# EAGLE design Acuator-MKI-RevisionCD (EAGLE 9.6.2)

## Sheet 1 of 2: Part Schematics
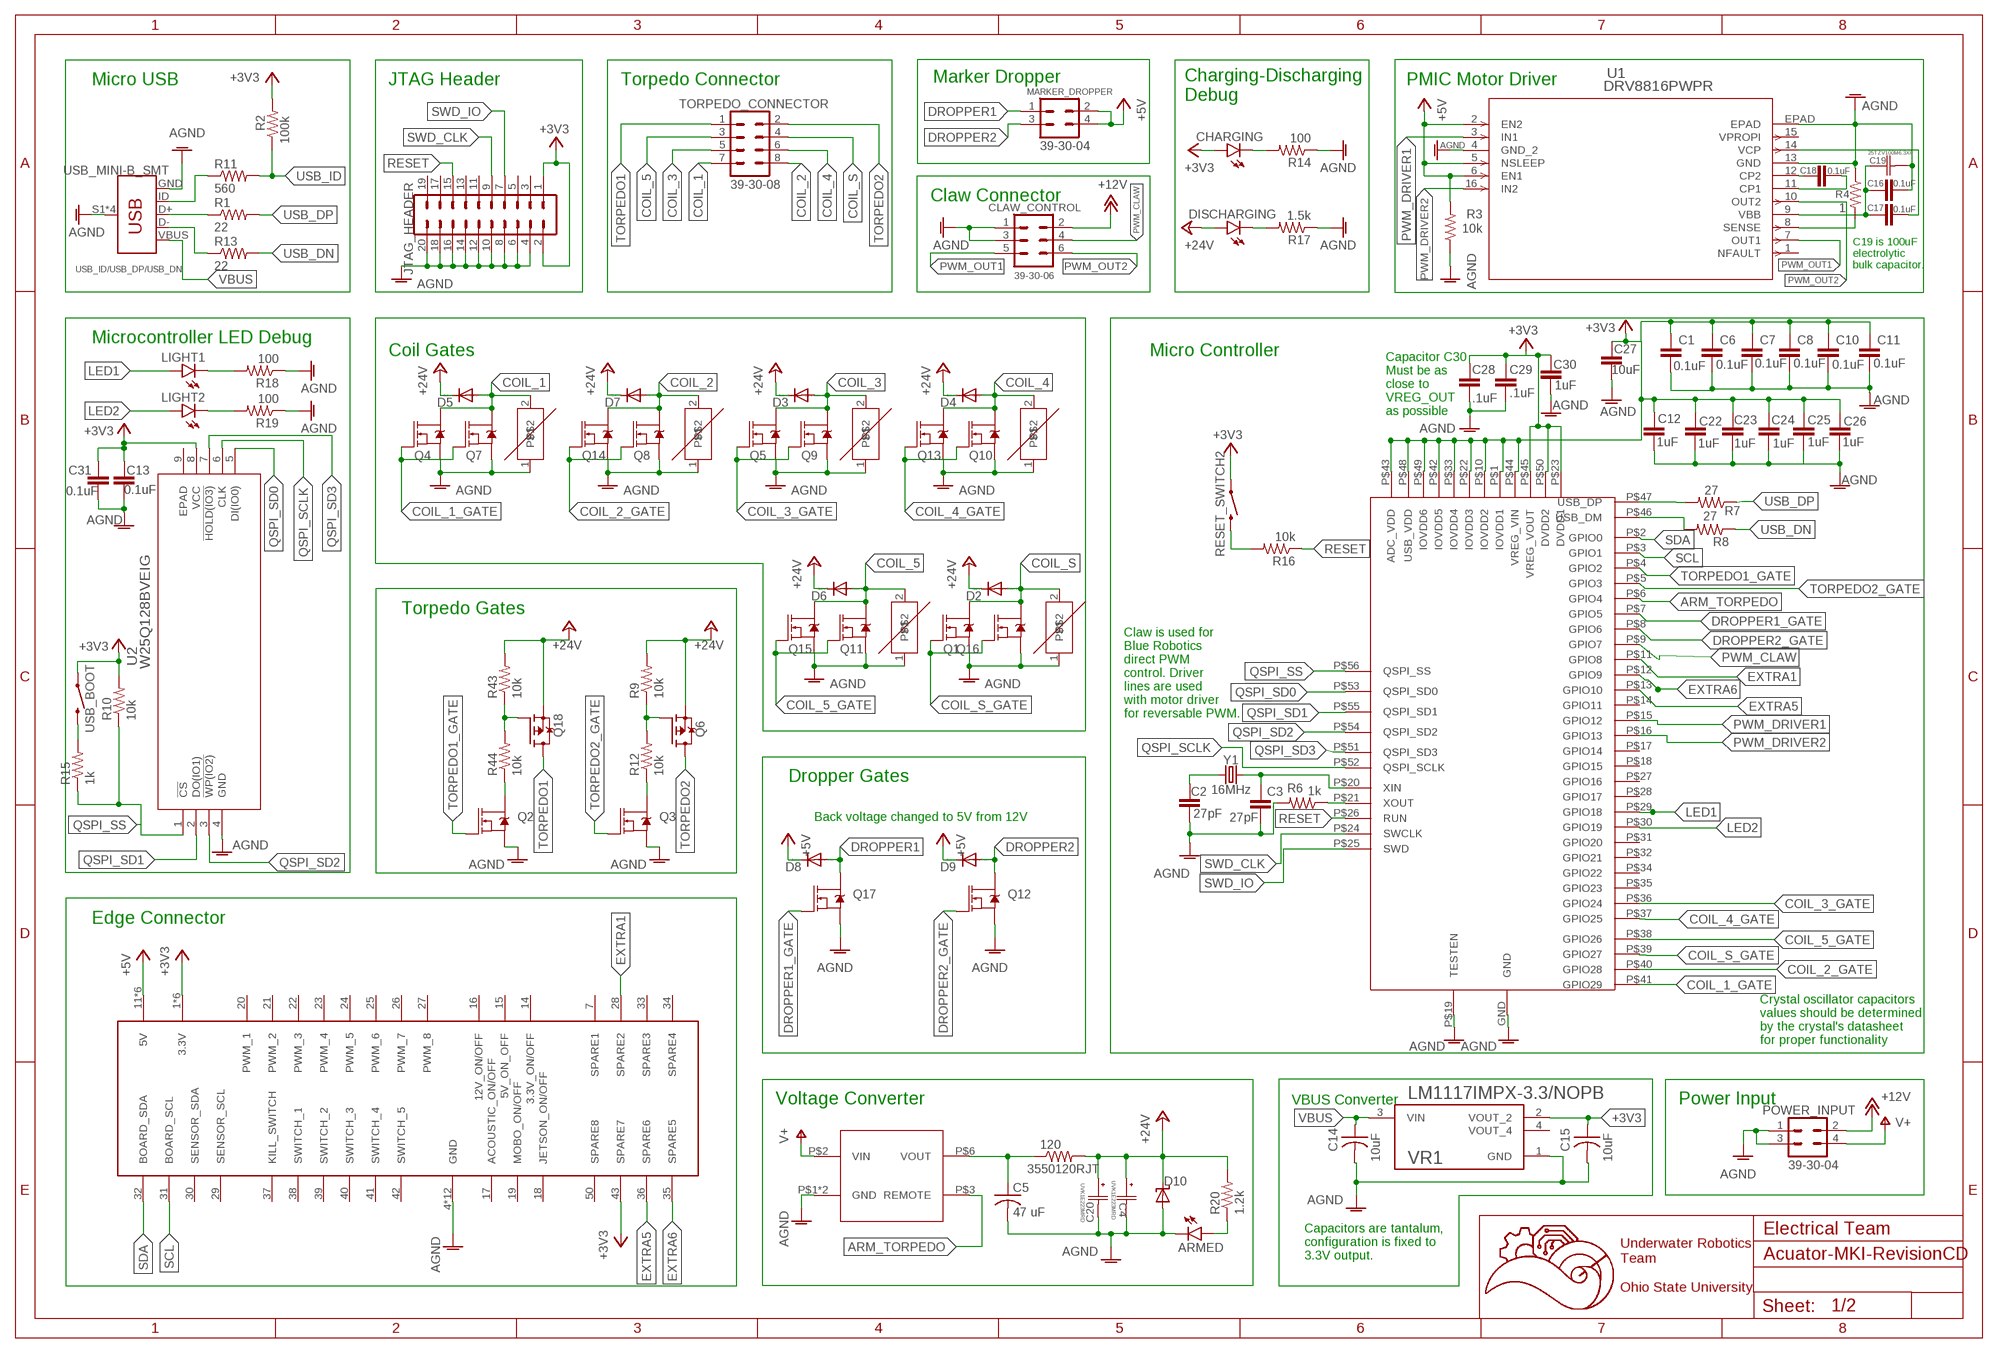
[diagram p0: schematic, sheet 1]

### Parts
120  3550120RJT  [3550120RJT]
ARMED  LEDCHIPLED_0603  [CHIPLED_0603]
C1  0.1uF  C-EUC0603  [C0603]
C2  27pF  C-EUC0603  [C0603]
C3  27pF  C-EUC0603  [C0603]
C4  UVK1E223MRD  [CAP_UFW_25X50_NCH]
C5  47 uF  C-USC1206K  [C1206K]
C6  0.1uF  C-EUC0603  [C0603]
C7  0.1uF  C-EUC0603  [C0603]
C8  0.1uF  C-EUC0603  [C0603]
C10  0.1uF  C-EUC0603  [C0603]
C11  0.1uF  C-EUC0603  [C0603]
C12  1uF  C-EUC0603  [C0603]
C13  0.1uF  C-EUC0603  [C0603]
C14  10uF  C-USC0603  [C0603]
C15  10uF  C-USC0603  [C0603]
C16  0.1uF  C-EUC0603  [C0603]
C17  0.1uF  C-EUC0603  [C0603]
C18  0.1uF  C-EUC0603  [C0603]
C19  25TZV100M6.3X8  [CAP_J-V_6P3X8_RUB]
C20  UVK1E223MRD  [CAP_UFW_25X50_NCH]
C22  1uF  C-EUC0603  [C0603]
C23  1uF  C-EUC0603  [C0603]
C24  1uF  C-EUC0603  [C0603]
C25  1uF  C-EUC0603  [C0603]
C26  1uF  C-EUC0603  [C0603]
C27  10uF  C-EUC0603  [C0603]
C28  .1uF  C-EUC0603  [C0603]
C29  .1uF  C-EUC0603  [C0603]
C30  1uF  C-EUC0603  [C0603]
C31  0.1uF  C-EUC0603  [C0603]
CHARGING  LEDCHIPLED_0603  [CHIPLED_0603]
CLAW_CONTROL  39-30-06  [39-30-?06?]
D2  DIODE-SMB  [SMB]
D3  DIODE-SMB  [SMB]
D4  DIODE-SMB  [SMB]
D5  DIODE-SMB  [SMB]
D6  DIODE-SMB  [SMB]
D7  DIODE-SMB  [SMB]
D8  DIODE-SMB  [SMB]
D9  DIODE-SMB  [SMB]
D10  SUPPRESSOR-SMBJ  [SMBJ]
DISCHARGING  LEDCHIPLED_0603  [CHIPLED_0603]
JTAG_HEADER  CONN_10X2  [2X10]
LIGHT1  LEDCHIPLED_0603  [CHIPLED_0603]
LIGHT2  LEDCHIPLED_0603  [CHIPLED_0603]
MARKER_DROPPER  39-30-04  [39-30-?04?]
POWER_INPUT  39-30-04  [39-30-?04?]
Q1  MOSFET-NCH-AO3404A  [SOT23-3]
Q2  MOSFET-NCH-AO3404A  [SOT23-3]
Q3  MOSFET-NCH-AO3404A  [SOT23-3]
Q4  MOSFET-NCH-AO3404A  [SOT23-3]
Q5  MOSFET-NCH-AO3404A  [SOT23-3]
Q6  FDD4141TO252  [TO252]
Q7  MOSFET-NCH-AO3404A  [SOT23-3]
Q8  MOSFET-NCH-AO3404A  [SOT23-3]
Q9  MOSFET-NCH-AO3404A  [SOT23-3]
Q10  MOSFET-NCH-AO3404A  [SOT23-3]
Q11  MOSFET-NCH-AO3404A  [SOT23-3]
Q12  MOSFET-NCH-AO3404A  [SOT23-3]
Q13  MOSFET-NCH-AO3404A  [SOT23-3]
Q14  MOSFET-NCH-AO3404A  [SOT23-3]
Q15  MOSFET-NCH-AO3404A  [SOT23-3]
Q16  MOSFET-NCH-AO3404A  [SOT23-3]
Q17  MOSFET-NCH-AO3404A  [SOT23-3]
Q18  FDD4141TO252  [TO252]
R1  22  R-US_R0603  [R0603]
R2  100k  R-US_R0603  [R0603]
R3  10k  R-US_R0603  [R0603]
R4  1  R-US_R0805  [R0805]
R6  1k  R-US_R0603  [R0603]
R7  27  R-US_R0603  [R0603]
R8  27  R-US_R0603  [R0603]
R9  10k  R-US_R0603  [R0603]
R10  10k  R-US_R0603  [R0603]
R11  560  R-US_R0603  [R0603]
R12  10k  R-US_R0603  [R0603]
R13  22  R-US_R0603  [R0603]
R14  100  R-US_R0805  [R0805]
R15  1k  R-US_R0603  [R0603]
R16  10k  R-US_R0603  [R0603]
R17  1.5k  R-US_R0805  [R0805]
R18  100  R-US_R0805  [R0805]
R19  100  R-US_R0805  [R0805]
R20  1.2k  R-US_R0805  [R0805]
R43  10k  R-US_R0603  [R0603]
R44  10k  R-US_R0603  [R0603]
RESET_SWITCH2  MOMENTARY-SWITCH-SPST-PTH-6.0MM  [TACTILE_SWITCH_PTH_6.0MM]
TORPEDO_CONNECTOR  39-30-08  [39-30-?08?]
U1  DRV8816PWPR  [PWP_16]
U2  W25Q128BVEIG  [WIN_E-8_WIN]
U$1  5530843-EDGE  [5530843-6-BOARDFINGERS]
U$2  ERZ-VF2M270ERZ-VF2M270  [RESM8060X320N]
U$3  ERZ-VF2M270ERZ-VF2M270  [RESM8060X320N]
U$4  ERZ-VF2M270ERZ-VF2M270  [RESM8060X320N]
U$5  ERZ-VF2M270ERZ-VF2M270  [RESM8060X320N]
U$6  TMR6-2415  [TMR6-2415]
U$7  ERZ-VF2M270ERZ-VF2M270  [RESM8060X320N]
U$8  ERZ-VF2M270ERZ-VF2M270  [RESM8060X320N]
U$9  RP2040  [RP2040]
USB_BOOT  MOMENTARY-SWITCH-SPST-PTH-6.0MM  [TACTILE_SWITCH_PTH_6.0MM]
USB_ID/USB_DP/USB_DN  USB_MINI-B_SMT  [USB-MINIB]
VR1  LM1117IMPX-3.3/NOPB  [VREG_LM1117IMPX-3.3/NOPB]
Y1  16MHz  CRYSTAL-16MHZPTH-HC49US  [HC49US]

### Nets
+3V3: C1.1 C6.1 C7.1 C8.1 C10.1 C11.1 C12.1 C13.1 C15.1 C22.1 C23.1 C24.1 C25.1 C26.1 C27.1 C28.1 C29.1 C30.1 C31.1 CHARGING.A JTAG_HEADER.1 JTAG_HEADER.2 R2.2 R10.2 RESET_SWITCH2.1 U2.8(VCC) U$1.1(3.3V) U$1.2(3.3V) U$1.3(3.3V) U$1.43(SPARE7) U$1.54(3.3V) U$1.55(3.3V) U$1.56(3.3V) U$9.P$1(IOVDD1) U$9.P$10(IOVDD2) U$9.P$22(IOVDD3) U$9.P$23(DVDD1) U$9.P$33(IOVDD4) U$9.P$42(IOVDD5) U$9.P$43(ADC_VDD) U$9.P$44(VREG_VIN) U$9.P$45(VREG_VOUT) U$9.P$48(USB_VDD) U$9.P$49(IOVDD6) U$9.P$50(DVDD2) USB_BOOT.1 VR1.2(VOUT_2)
+5V: D8.C D9.C MARKER_DROPPER.2 MARKER_DROPPER.4 R3.2 U1.2(EN2) U1.5(NSLEEP) U1.6(EN1) U$1.11(5V) U$1.12(5V) U$1.13(5V) U$1.44(5V) U$1.45(5V) U$1.46(5V)
+12V: CLAW_CONTROL.2 POWER_INPUT.2
+24V: 120.P$2 C4.1 C20.1 D2.C D3.C D4.C D5.C D6.C D7.C D10.C DISCHARGING.A Q6.2(S) Q18.2(S) R9.2 R20.2 R43.2
AGND: ARMED.C C1.2 C2.2 C3.2 C4.2 C5.2 C6.2 C7.2 C8.2 C10.2 C11.2 C12.2 C13.2 C14.2 C15.2 C16.2 C19.2 C20.2 C22.2 C23.2 C24.2 C25.2 C26.2 C27.2 C28.2 C29.2 C30.2 C31.2 CLAW_CONTROL.1 CLAW_CONTROL.3 D10.A JTAG_HEADER.4 JTAG_HEADER.6 JTAG_HEADER.8 JTAG_HEADER.10 JTAG_HEADER.12 JTAG_HEADER.14 JTAG_HEADER.16 JTAG_HEADER.18 JTAG_HEADER.20 POWER_INPUT.1 POWER_INPUT.3 Q1.2(S) Q2.2(S) Q3.2(S) Q4.2(S) Q5.2(S) Q7.2(S) Q8.2(S) Q9.2(S) Q10.2(S) Q11.2(S) Q12.2(S) Q13.2(S) Q14.2(S) Q15.2(S) Q16.2(S) Q17.2(S) R3.1 R4.1 R6.2 R14.1 R17.1 R18.1 R19.1 U1.4(GND_2) U1.13(GND) U1.EPAD U2.4(GND) U$1.4(GND) U$1.5(GND) U$1.6(GND) U$1.8(GND) U$1.9(GND) U$1.10(GND) U$1.47(GND) U$1.48(GND) U$1.49(GND) U$1.51(GND) U$1.52(GND) U$1.53(GND) U$2.1 U$3.1 U$4.1 U$5.1 U$6.P$1(GND) U$6.P$7(GND) U$7.1 U$8.1 U$9.GND U$9.P$19(TESTEN) USB_ID/USB_DP/USB_DN.GND USB_ID/USB_DP/USB_DN.S1(SHIELD) USB_ID/USB_DP/USB_DN.S2(SHIELD) USB_ID/USB_DP/USB_DN.S3(SHIELD) USB_ID/USB_DP/USB_DN.S4(SHIELD) VR1.1(GND)
ARM_TORPEDO: U$6.P$3(REMOTE) U$9.P$6(GPIO4)
COIL_1: D5.A Q4.3(D) Q7.3(D) TORPEDO_CONNECTOR.7 U$8.2
COIL_1_GATE: Q4.1(G) Q7.1(G) U$9.P$41(GPIO29)
COIL_2: D7.A Q8.3(D) Q14.3(D) TORPEDO_CONNECTOR.8 U$7.2
COIL_2_GATE: Q8.1(G) Q14.1(G) U$9.P$40(GPIO28)
COIL_3: D3.A Q5.3(D) Q9.3(D) TORPEDO_CONNECTOR.5 U$5.2
COIL_3_GATE: Q5.1(G) Q9.1(G) U$9.P$36(GPIO24)
COIL_4: D4.A Q10.3(D) Q13.3(D) TORPEDO_CONNECTOR.6 U$4.2
COIL_4_GATE: Q10.1(G) Q13.1(G) U$9.P$37(GPIO25)
COIL_5: D6.A Q11.3(D) Q15.3(D) TORPEDO_CONNECTOR.3 U$3.2
COIL_5_GATE: Q11.1(G) Q15.1(G) U$9.P$38(GPIO26)
COIL_S: D2.A Q1.3(D) Q16.3(D) TORPEDO_CONNECTOR.4 U$2.2
COIL_S_GATE: Q1.1(G) Q16.1(G) U$9.P$39(GPIO27)
DROPPER1: D8.A MARKER_DROPPER.1 Q17.3(D)
DROPPER1_GATE: Q17.1(G) U$9.P$7(GPIO5)
DROPPER2: D9.A MARKER_DROPPER.3 Q12.3(D)
DROPPER2_GATE: Q12.1(G) U$9.P$8(GPIO6)
EXTRA1: U$1.28(SPARE2) U$9.P$11(GPIO8)
EXTRA5: U$1.36(SPARE6) U$9.P$13(GPIO10)
EXTRA6: U$1.35(SPARE5) U$9.P$12(GPIO9)
LED1: LIGHT1.A U$9.P$29(GPIO18)
LED2: LIGHT2.A U$9.P$30(GPIO19)
N$2: C2.1 Y1.1
N$3: C3.1 U$9.P$20(XIN) Y1.2
N$4: CHARGING.C R14.2
N$5: R6.1 U$9.P$21(XOUT)
N$6: R11.1 USB_ID/USB_DP/USB_DN.ID
N$7: R1.1 USB_ID/USB_DP/USB_DN.D+
N$8: R13.1 USB_ID/USB_DP/USB_DN.D-
N$10: ARMED.A R20.1
N$11: R7.2 U$9.P$47(USB_DP)
N$12: R8.2 U$9.P$46(USB_DM)
N$15: DISCHARGING.C R17.2
N$16: LIGHT1.C R18.2
N$17: LIGHT2.C R19.2
N$18: R15.2 USB_BOOT.3
N$19: R16.2 RESET_SWITCH2.3
N$26: 120.P$1 C5.1 U$6.P$6(VOUT)
N$33: Q18.1(G) R43.1 R44.2
N$34: Q2.3(D) R44.1
N$35: Q6.1(G) R9.1 R12.2
N$36: Q3.3(D) R12.1
N$45: R4.2 U1.8(SENSE)
N$46: C17.2 U1.14(VCP)
N$47: C16.1 C17.1 C19.1 U1.9(VBB)
N$48: C18.2 U1.11(CP1)
N$49: C18.1 U1.12(CP2)
PWM_CLAW: CLAW_CONTROL.4 U$9.P$9(GPIO7)
PWM_DRIVER1: U1.3(IN1) U$9.P$15(GPIO12)
PWM_DRIVER2: U1.16(IN2) U$9.P$16(GPIO13)
PWM_OUT1: CLAW_CONTROL.5 U1.7(OUT1)
PWM_OUT2: CLAW_CONTROL.6 U1.10(OUT2)
QSPI_SCLK: U2.6(CLK) U$9.P$52(QSPI_SCLK)
QSPI_SD0: U2.5(DI(IO0)) U$9.P$53(QSPI_SD0)
QSPI_SD1: U2.2(DO(IO1)) U$9.P$55(QSPI_SD1)
QSPI_SD2: U2.3(!WP(IO2)) U$9.P$54(QSPI_SD2)
QSPI_SD3: U2.7(!HOLD(IO3)) U$9.P$51(QSPI_SD3)
QSPI_SS: R10.1 R15.1 U2.1(!CS) U$9.P$56(QSPI_SS)
RESET: JTAG_HEADER.15 R16.1 U$9.P$26(RUN)
SCL: U$1.31(BOARD_SCL) U$9.P$3(GPIO1)
SDA: U$1.32(BOARD_SDA) U$9.P$2(GPIO0)
SWD_CLK: JTAG_HEADER.9 U$9.P$24(SWCLK)
SWD_IO: JTAG_HEADER.7 U$9.P$25(SWD)
TORPEDO1: Q18.3(D) TORPEDO_CONNECTOR.1
TORPEDO1_GATE: Q2.1(G) U$9.P$4(GPIO2)
TORPEDO2: Q6.3(D) TORPEDO_CONNECTOR.2
TORPEDO2_GATE: Q3.1(G) U$9.P$5(GPIO3)
USB_DN: R8.1 R13.2
USB_DP: R1.2 R7.1
USB_ID: R2.1 R11.2
V+: POWER_INPUT.4 U$6.P$2(VIN)
VBUS: C14.1 USB_ID/USB_DP/USB_DN.VBUS VR1.3(VIN)
Unconnected: JTAG_HEADER.3 JTAG_HEADER.5 JTAG_HEADER.11 JTAG_HEADER.13 JTAG_HEADER.17 JTAG_HEADER.19 U1.1(NFAULT) U1.15(VPROPI) U2.9(EPAD) U$1.7(SPARE1) U$1.14(3.3V_ON/OFF) U$1.15(5V_ON_OFF) U$1.16(12V_ON/OFF) U$1.17(ACOUSTIC_ON/OFF) U$1.18(JETSON_ON/OFF) U$1.19(MOBO_ON/OFF) U$1.20(PWM_1) U$1.21(PWM_2) U$1.22(PWM_3) U$1.23(PWM_4) U$1.24(PWM_5) U$1.25(PWM_6) U$1.26(PWM_7) U$1.27(PWM_8) U$1.29(SENSOR_SCL) U$1.30(SENSOR_SDA) U$1.33(SPARE3) U$1.34(SPARE4) U$1.37(KILL_SWITCH) U$1.38(SWITCH_1) U$1.39(SWITCH_2) U$1.40(SWITCH_3) U$1.41(SWITCH_4) U$1.42(SWITCH_5) U$1.50(SPARE8) U$9.P$14(GPIO11) U$9.P$17(GPIO14) U$9.P$18(GPIO15) U$9.P$27(GPIO16) U$9.P$28(GPIO17) U$9.P$31(GPIO20) U$9.P$32(GPIO21) U$9.P$34(GPIO22) U$9.P$35(GPIO23) VR1.4(VOUT_4)

### Notes on the sheet
- Micro USB | JTAG Header | Torpedo Connector | Marker Dropper | PMIC Motor Driver
- Charging-Discharging 
  Debug
- Claw Connector
- C19 is 100uF
  electrolytic
  bulk capacitor.
- Microcontroller LED Debug
- Coil Gates | Micro Controller
- Capacitor C30 
  Must be as 
  close to 
  VREG_OUT
  as possible
- Torpedo Gates
- Claw is used for
  Blue Robotics
  direct PWM
  control. Driver
  lines are used
  with motor driver
  for reversable PWM.
- Dropper Gates
- Back voltage changed to 5V from 12V
- Edge Connector
- Crystal oscillator capacitors
  values should be determined
  by the crystal's datasheet
  for proper functionality
- Voltage Converter | VBUS Converter | Power Input
- Electrical Team
- Capacitors are tantalum, 
  configuration is fixed to 
  3.3V output.
- Underwater Robotics
  Team
  
  Ohio State University

## Sheet 2 of 2: Notes
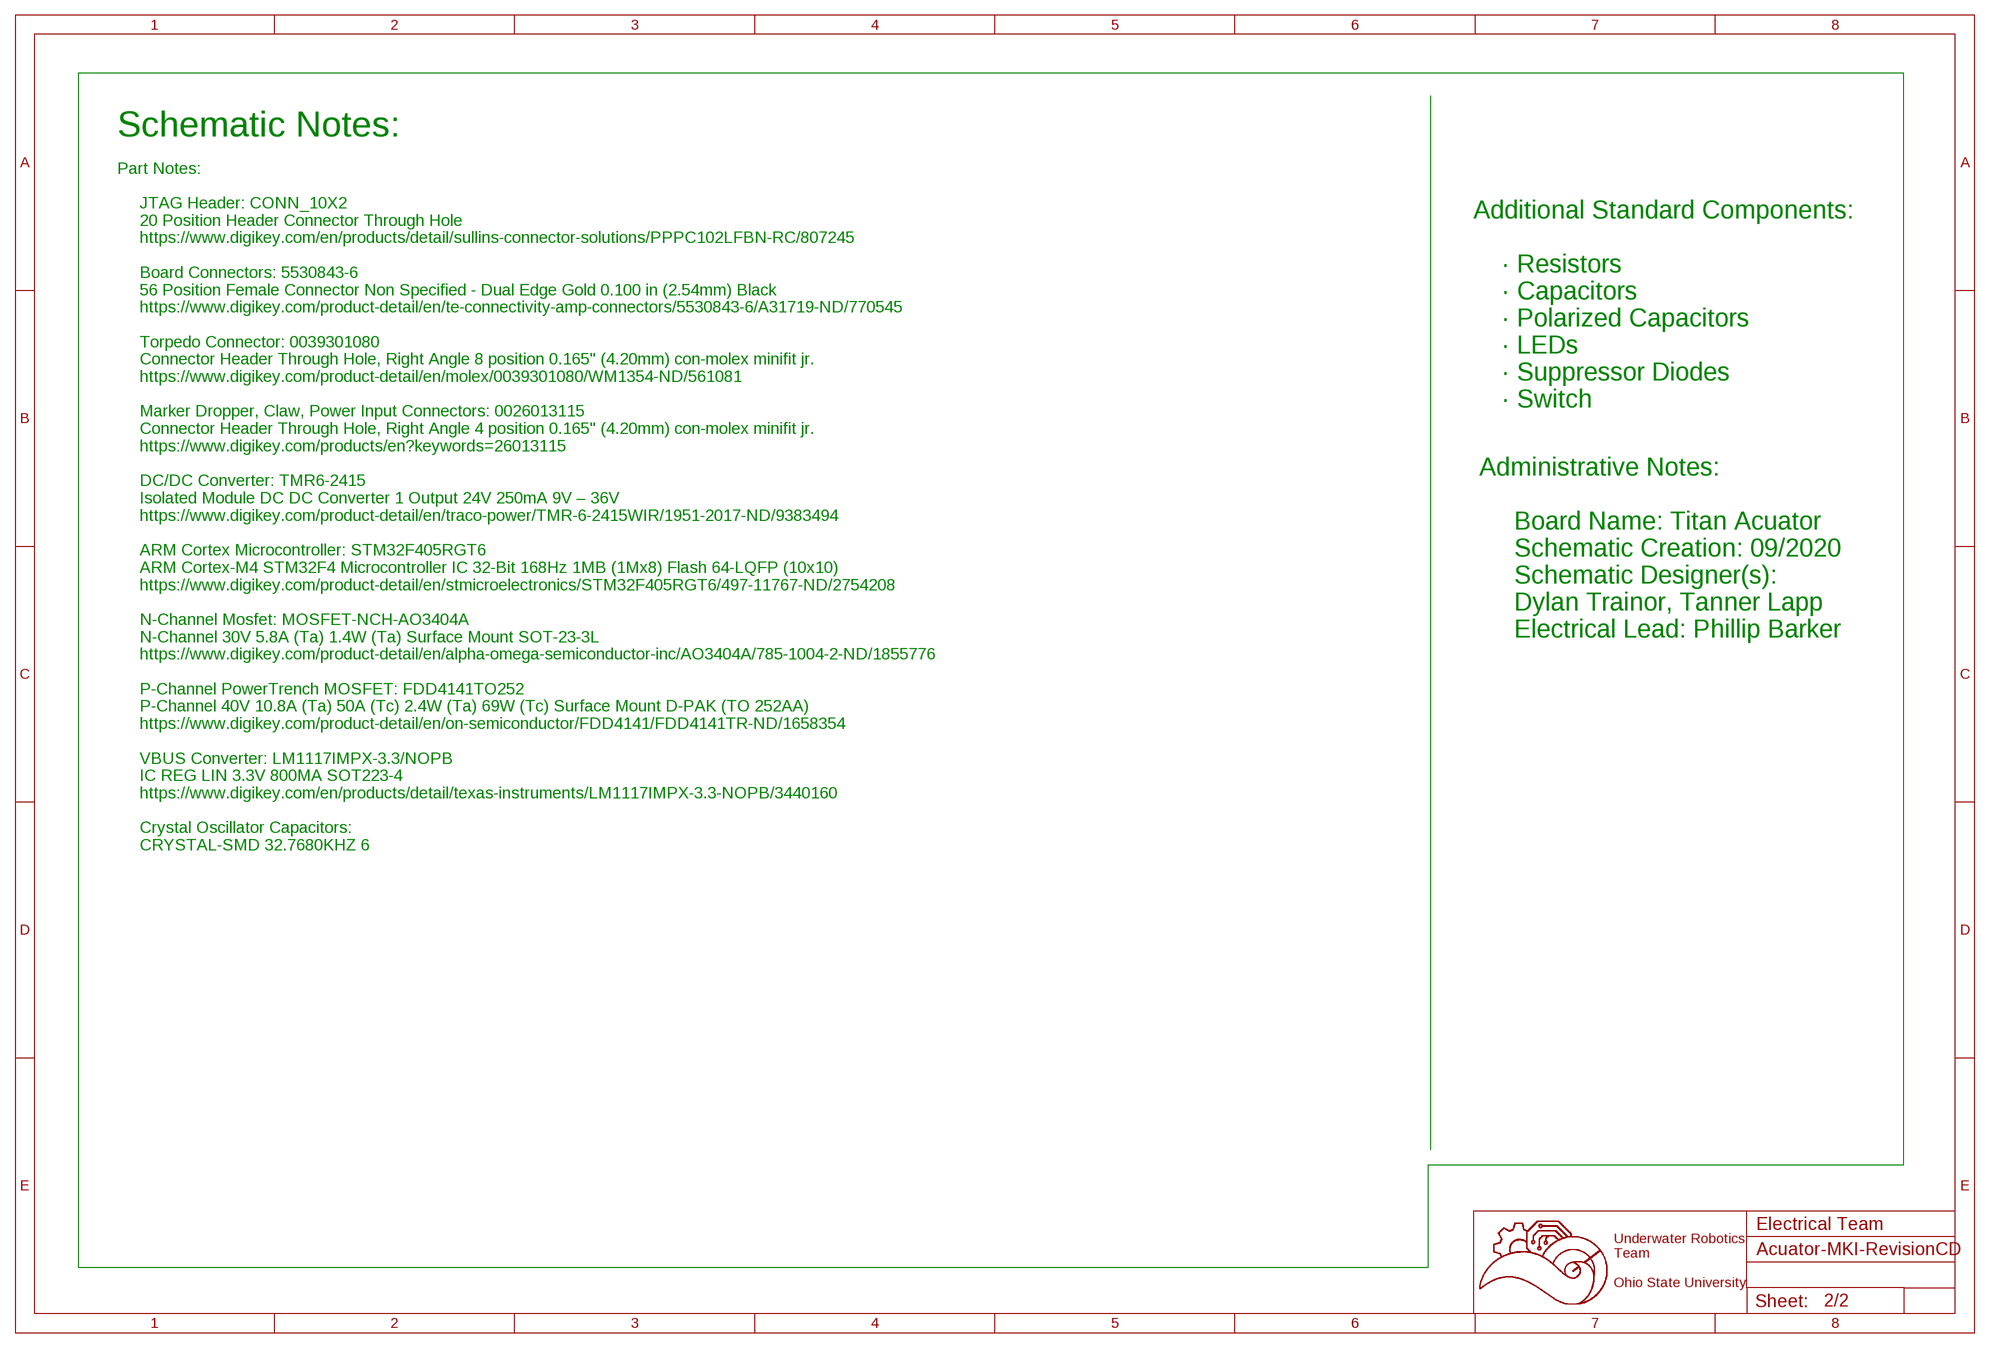
[diagram p1: schematic, sheet 2]

### Notes on the sheet
- Schematic Notes:
- Part Notes:
  
       JTAG Header: CONN_10X2
       20 Position Header Connector Through Hole 
       https://www.digikey.com/en/products/detail/sullins-connector-solutions/PPPC102LFBN-RC/807245
    
       Board Connectors: 5530843-6 
       56 Position Female Connector Non Specified - Dual Edge Gold 0.100 in (2.54mm) Black 
       https://www.digikey.com/product-detail/en/te-connectivity-amp-connectors/5530843-6/A31719-ND/770545 
    
       Torpedo Connector: 0039301080 
       Connector Header Through Hole, Right Angle 8 position 0.165" (4.20mm) con-molex minifit jr. 
       https://www.digikey.com/product-detail/en/molex/0039301080/WM1354-ND/561081 
    
       Marker Dropper, Claw, Power Input Connectors: 0026013115 
       Connector Header Through Hole, Right Angle 4 position 0.165" (4.20mm) con-molex minifit jr. 
       https://www.digikey.com/products/en?keywords=26013115 
    
       DC/DC Converter: TMR6-2415 
       Isolated Module DC DC Converter 1 Output 24V 250mA 9V – 36V 
       https://www.digikey.com/product-detail/en/traco-power/TMR-6-2415WIR/1951-2017-ND/9383494 
    
       ARM Cortex Microcontroller: STM32F405RGT6 
       ARM Cortex-M4 STM32F4 Microcontroller IC 32-Bit 168Hz 1MB (1Mx8) Flash 64-LQFP (10x10) 
       https://www.digikey.com/product-detail/en/stmicroelectronics/STM32F405RGT6/497-11767-ND/2754208 
    
       N-Channel Mosfet: MOSFET-NCH-AO3404A 
       N-Channel 30V 5.8A (Ta) 1.4W (Ta) Surface Mount SOT-23-3L 
       https://www.digikey.com/product-detail/en/alpha-omega-semiconductor-inc/AO3404A/785-1004-2-ND/1855776 
    
       P-Channel PowerTrench MOSFET: FDD4141TO252 
       P-Channel 40V 10.8A (Ta) 50A (Tc) 2.4W (Ta) 69W (Tc) Surface Mount D-PAK (TO 252AA) 
       https://www.digikey.com/product-detail/en/on-semiconductor/FDD4141/FDD4141TR-ND/1658354
  
       VBUS Converter: LM1117IMPX-3.3/NOPB
       IC REG LIN 3.3V 800MA SOT223-4
       https://www.digikey.com/en/products/detail/texas-instruments/LM1117IMPX-3.3-NOPB/3440160
    
       Crystal Oscillator Capacitors: 
       CRYSTAL-SMD 32.7680KHZ 6PF  3.2X1.5MM 
       https://www.digikey.com/en/products/detail/micro-crystal-ag/CM7V-T1A-32-768KHZ-6PF-20PPM-TA-QC/10499118
       CRYSTAL-16MHZPTH-HC49US (CRYSTAL-16MHZ)
       https://www.digikey.com/en/products/detail/abracon-llc/ABM3B-16-000MHZ-B2-T/675317?s=N4IgTCBcDaIKwGY4FoCcBGMZnuQOQBEQBdAXyA 
  
       ERZ-VF2M270 Varistor
       VARISTOR 27V 125A 2SMD JLEAD
       https://www.digikey.com/en/products/detail/panasonic-electronic-components/ERZ-VF2M270/672899
  
       3550120RJT Resistor
       RES 3550 120 Ohm 5% 5W
       https://www.digikey.com/en/products/detail/te-connectivity-passive-product/3550120RJT/9927251
  
       DRV8816PWPR Motor Driver
       IC MOTOR DRIVER 8V-38V 16HTSSOP
       https://www.digikey.com/en/products/detail/texas-instruments/DRV8816PWPR/4439658
  
       25TZV100M6.3X8 Electrolytic Capacitor
       CAP ALUM 100UF 20% 25V SMD
       https://www.digikey.com/en/products/detail/rubycon/25TZV100M6-3X8/3134865
  
       UVK1E223MRD 22mF Capacitor
       CAP ALUM 22000UF 20% 25V RADIAL
       https://www.digikey.com/en/products/detail/nichicon/UVK1E223MRD/2539394
- Additional Standard Components:
  
       · Resistors 
       · Capacitors 
       · Polarized Capacitors 
       · LEDs 
       · Suppressor Diodes 
       · Switch
- Administrative Notes:
  
       Board Name: Titan Acuator
       Schematic Creation: 09/2020
       Schematic Designer(s): 
       Dylan Trainor, Tanner Lapp
       Electrical Lead: Phillip Barker
- Electrical Team
- Underwater Robotics
  Team
  
  Ohio State University

## Library data of the parts
120 = 3550120RJT:3550120RJT
ARMED CHARGING DISCHARGING LIGHT1 LIGHT2 = led:LED: LED OSRAM: - CHIPLED LG R971, LG N971, LY N971, LG Q971, LY Q971, LO R971, LY R971 LH N974, LH R974 LS Q976, LO Q976, LY Q976 LO Q996 - Hyper CHIPLED LW Q18S LB Q993, LB Q99A, LB R99A - SideLED LS A670, LO A670, LY A670, LG A670, LP A670 LB A673, LV A673, LT A673, LW A673 LH A674 LY A675 LS A676, LA A676, LO A676, LY A676, LW A676 LS A679, LY A679, LG A679 - Hyper Micro SIDELED® LS Y876, LA Y876, LO Y876, LY Y876 LT Y87S - SmartLED LW L88C, LW L88S LB L89C, LB L89S, LG L890 LS L89K, LO L89K, LY L89K LS L896, LA L896, LO L896, LY L896 - TOPLED LS T670, LO T670, LY T670, LG T670, LP T670 LSG T670, LSP T670, LSY T670, LOP T670, LYG T670 LG T671, LOG T671, LSG T671 LB T673, LV T673, LT T673, LW T673 LH T674 LS T676, LA T676, LO T676, LY T676, LB T676, LH T676, LSB T676, LW T676 LB T67C, LV T67C, LT T67C, LS T67K, LO T67K, LY T67K, LW E67C LS E67B, LA E67B, LO E67B, LY E67B, LB E67C, LV E67C, LT E67C LW T67C LS T679, LY T679, LG T679 LS T770, LO T770, LY T770, LG T770, LP T770 LB T773, LV T773, LT T773, LW T773 LH T774 LS E675, LA E675, LY E675, LS T675 LS T776, LA T776, LO T776, LY T776, LB T776 LHGB T686 LT T68C, LB T68C - Hyper Mini TOPLED® LB M676 - Mini TOPLED Santana® LG M470 LS M47K, LO M47K, LY M47K Source: http://www.osram.convergy.de LUXEON: - LUMILED® LXK2-PW12-R00, LXK2-PW12-S00, LXK2-PW14-U00, LXK2-PW14-V00 LXK2-PM12-R00, LXK2-PM12-S00, LXK2-PM14-U00 LXK2-PE12-Q00, LXK2-PE12-R00, LXK2-PE12-S00, LXK2-PE14-T00, LXK2-PE14-U00 LXK2-PB12-K00, LXK2-PB12-L00, LXK2-PB12-M00, LXK2-PB14-N00, LXK2-PB14-P00, LXK2-PB14-Q00 LXK2-PR12-L00, LXK2-PR12-M00, LXK2-PR14-Q00, LXK2-PR14-R00 LXK2-PD12-Q00, LXK2-PD12-R00, LXK2-PD12-S00 LXK2-PH12-R00, LXK2-PH12-S00 LXK2-PL12-P00, LXK2-PL12-Q00, LXK2-PL12-R00 Source: www.luxeon.com KINGBRIGHT: KA-3528ASYC Source: www.kingbright.com
C1-C3 C6-C8 C10-C13 C16-C18 C22-C31 = rcl:C-EU: CAPACITOR, European symbol; SPICEPREFIX: C
C4 C20 = UVK1E223MRD:UVK1E223MRD; BUILT_BY: EMA_Cory; COPYRIGHT: Copyright (C) 2018 Accelerated Designs. All rights reserved; MANUFACTURER_PART_NUMBER: UVK1E223MRD; SOURCELIBRARY: Nichicon_2019-09-13; VENDOR: Nichicon
C5 = resistor:C-US: CAPACITOR, American symbol
C14 C15 = rcl:C-US: CAPACITOR, American symbol; SPICEPREFIX: C
C19 = 25TZV100M6_3X8:25TZV100M6.3X8; BUILT_BY: EMA_Cory; COPYRIGHT: Copyright (C) 2018 Accelerated Designs. All rights reserved; MANUFACTURER_PART_NUMBER: 25TZV100M6.3X8; SOURCELIBRARY: Rubycon_2019-09-19; VENDOR: Rubycon Netherlands
CLAW_CONTROL = con-molex-mini-fit:39-30-?06?: HEADER
D2-D9 = diode:DIODE-: DIODE
D10 = diode:SUPPRESSOR-: Suppressor diode
JTAG_HEADER = SparkFun-Connectors:CONN_10X2: Multi connection point. Often used as Generic Header-pin footprint for 0.1 inch spaced/style header connections On any of the 0.1 inch spaced packages, you can populate with these: Break Away Headers - Straight <https://www.sparkfun.com/products/116> (PRT-00116) Break Away Male Headers - Right Angle <https://www.sparkfun.com/products/553> (PRT-00553) Female Headers <https://www.sparkfun.com/products/115> (PRT-00115) Break Away Headers - Machine Pin <https://www.sparkfun.com/products/117> (PRT-00117) Break Away Female Headers - Swiss Machine Pin <https://www.sparkfun.com/products/743> (PRT-00743) Special note about the "SPECIAL" package: This was SPECIALLY designed to be used with our Graphic LCD Backpack. Be sure you want to use this! It is not only staggered on each line of header holes, but IT IS ALSO offset of the center point of the top and bottom lines by 5 mil. This causes the headers to lock into place on the "standard" footprint on the LCD screen. The extra squares on the tdocu layer are there simply to reference other pins (if you were to actually populate a longer header than ten long - this is what we do with the backpacks).
MARKER_DROPPER POWER_INPUT = con-molex-mini-fit:39-30-?04?: HEADER
Q1-Q5 Q7-Q17 = SparkFun-DiscreteSemi:MOSFET-NCH: N-channel MOSFETs Voltage controlled devices that allow control of high current outputs. SparkFun Products: SparkFun OpenScale <https://www.sparkfun.com/products/13261> SparkFun Digital Sandbox <https://www.sparkfun.com/products/12651> SparkFun Monster Moto Shield <https://www.sparkfun.com/products/10182> SparkFun MOSFET Power Controller <https://www.sparkfun.com/products/11214>; PROD_ID: TRANS-12988; VALUE: 5.8A/30V/35mΩ
Q6 Q18 = transistor-fet:FDD4141: P-Channel PowerTrench® MOSFET Source: FDD4141.pdf
R1 R2 R6-R8 R10 R11 R13 R15 R16 = rcl:R-US_: RESISTOR, American symbol; SPICEPREFIX: R
R3 R4 R9 R12 R14 R17-R20 R43 R44 = resistor:R-US_: RESISTOR, American symbol
RESET_SWITCH2 USB_BOOT = SparkFun-Switches:MOMENTARY-SWITCH-SPST: Momentary Switch (Pushbutton) - SPST Normally-open (NO) SPST momentary switches (buttons, pushbuttons). Variants PTH-12MM - 12mm square, through-hole Momentary Pushbutton Switch - 12mm Square <https://www.sparkfun.com/products/9190> (COM-09190) PTH-6.0MM, PTH-6.0MM-KIT - 6.0mm square, through-hole Mini Pushbutton Switch <https://www.sparkfun.com/products/97> (COM-00097) KIT package intended for soldering kit's - only one side of pads' copper is exposed. PTH-RIGHT-ANGLE-KIT - Right-angle, through-hole Right Angle Tactile Button <https://www.sparkfun.com/products/10791> - Used on SparkFun BigTime Watch Kit <https://www.sparkfun.com/products/11734> SMD-12MM - 12mm square, surface-mount Tactile Button - SMD (12mm) <https://www.sparkfun.com/products/12993> (COM-12993) Used on SparkFun PicoBoard <https://www.sparkfun.com/products/11888> SMD-4.5MM - 4.5mm Square Trackball Switch Used on SparkFun Blackberry Trackballer Breakout <https://www.sparkfun.com/products/13169> SMD-4.6MMX2.8MM - 4.60mm x 2.80mm, surface mount Used on SparkFun SAMD21 Mini Breakout <https://www.sparkfun.com/products/13664> SMD-5.2MM, SMD-5.2-REDUNDANT - 5.2mm square, surface-mount Mini Pushbutton Switch - SMD <https://www.sparkfun.com/products/8720> (COM-08720) Used on Arduino Pro Mini <https://www.sparkfun.com/products/11114> REDUNDANT package connects both switch circuits together SMD-6.0X3.5MM - 6.0 x 3.5mm, surface mount Momentary Reset Switch SMD <https://www.sparkfun.com/products/8229> (COM-08229) SMD-6.2MM-TALL - 6.2mm square, surface mount Tactile Button - SMD (6mm) <https://www.sparkfun.com/products/12992> Used on SparkFun Digital Sandbox <https://www.sparkfun.com/products/12651> SMD-RIGHT-ANGLE - Right-angle, surface mount Used on SparkFun Block for Intel® Edison - Arduino <https://www.sparkfun.com/products/13036>; PROD_ID: SWCH-08441; SF_SKU: COM-00097
TORPEDO_CONNECTOR = con-molex-mini-fit:39-30-?08?: HEADER
U1 = DRV8816POWPR:DRV8816PWPR; MANUFACTURER_PART_NUMBER: DRV8816PWPR; VENDOR: Texas Instruments
U2 = W25Q128JVSIQ (1):W25Q128BVEIG; COPYRIGHT: Copyright (C) 2021 Ultra Librarian. All rights reserved.; MANUFACTURER_PART_NUMBER: W25Q128BVEIG; MFR_NAME: Winbond
U$1 = 5530843-6:5530843-EDGE
U$2-U$5 U$7 U$8 = ERZ-VF2M270:ERZ-VF2M270
U$6 = converter:TMR6-2415
U$9 = RP2040:RP2040
USB_ID/USB_DP/USB_DN = SparkFun-Connectors:USB_MINI-B: USB type Mini-B Connector Breaks out 5th pin, and includes shield pins if needed. SparkFun Products: SparkFun FTDI Basic Breakout <https://www.sparkfun.com/products/9716> SparkFun XBee Explorer USB <https://www.sparkfun.com/products/11812> SparkFun Redboard <https://www.sparkfun.com/products/12757>; PROD_ID: CONN-08193; SF_ID: PRT-00587
VR1 = LM1117IMPX-3.3_NOPB:LM1117IMPX-3.3/NOPB: 800-mA 15-V linear voltage regulator 4-SOT-223 0 to 125 Check prices <https://pricing.snapeda.com/parts/LM1117IMPX-3.3/NOPB/Texas%20Instruments/view-part?ref=eda>; AVAILABILITY: Good; DESCRIPTION: 800-mA 15-V linear voltage regulator 4-SOT-223 -40 to 125; MF: Texas Instruments; MP: LM1117IMPX-3.3/NOPB; PACKAGE: SOT-223-4 Texas Instruments; PRICE: None; PURCHASE-URL: https://pricing.snapeda.com/search/part/LM1117IMPX-3.3/NOPB/?ref=eda
Y1 = SparkFun-Clocks:CRYSTAL-16MHZ: 16MHz Crystal Digikey Example <http://www.digikey.com/product-search/en?keywords=535-9122-1-ND> Frequency: 16MHz Frequency Stability: ±50ppm Frequency Tolerance: ±20ppm Load Capacitance: 18pF SparkFun Products: Pro Micro -5V/16MHz <https://www.sparkfun.com/products/12640> SparkFun Serial Enabled LCD Kit <https://www.sparkfun.com/products/10097>; PROD_ID: XTAL-08181; SF_ID: COM-00536

## Board
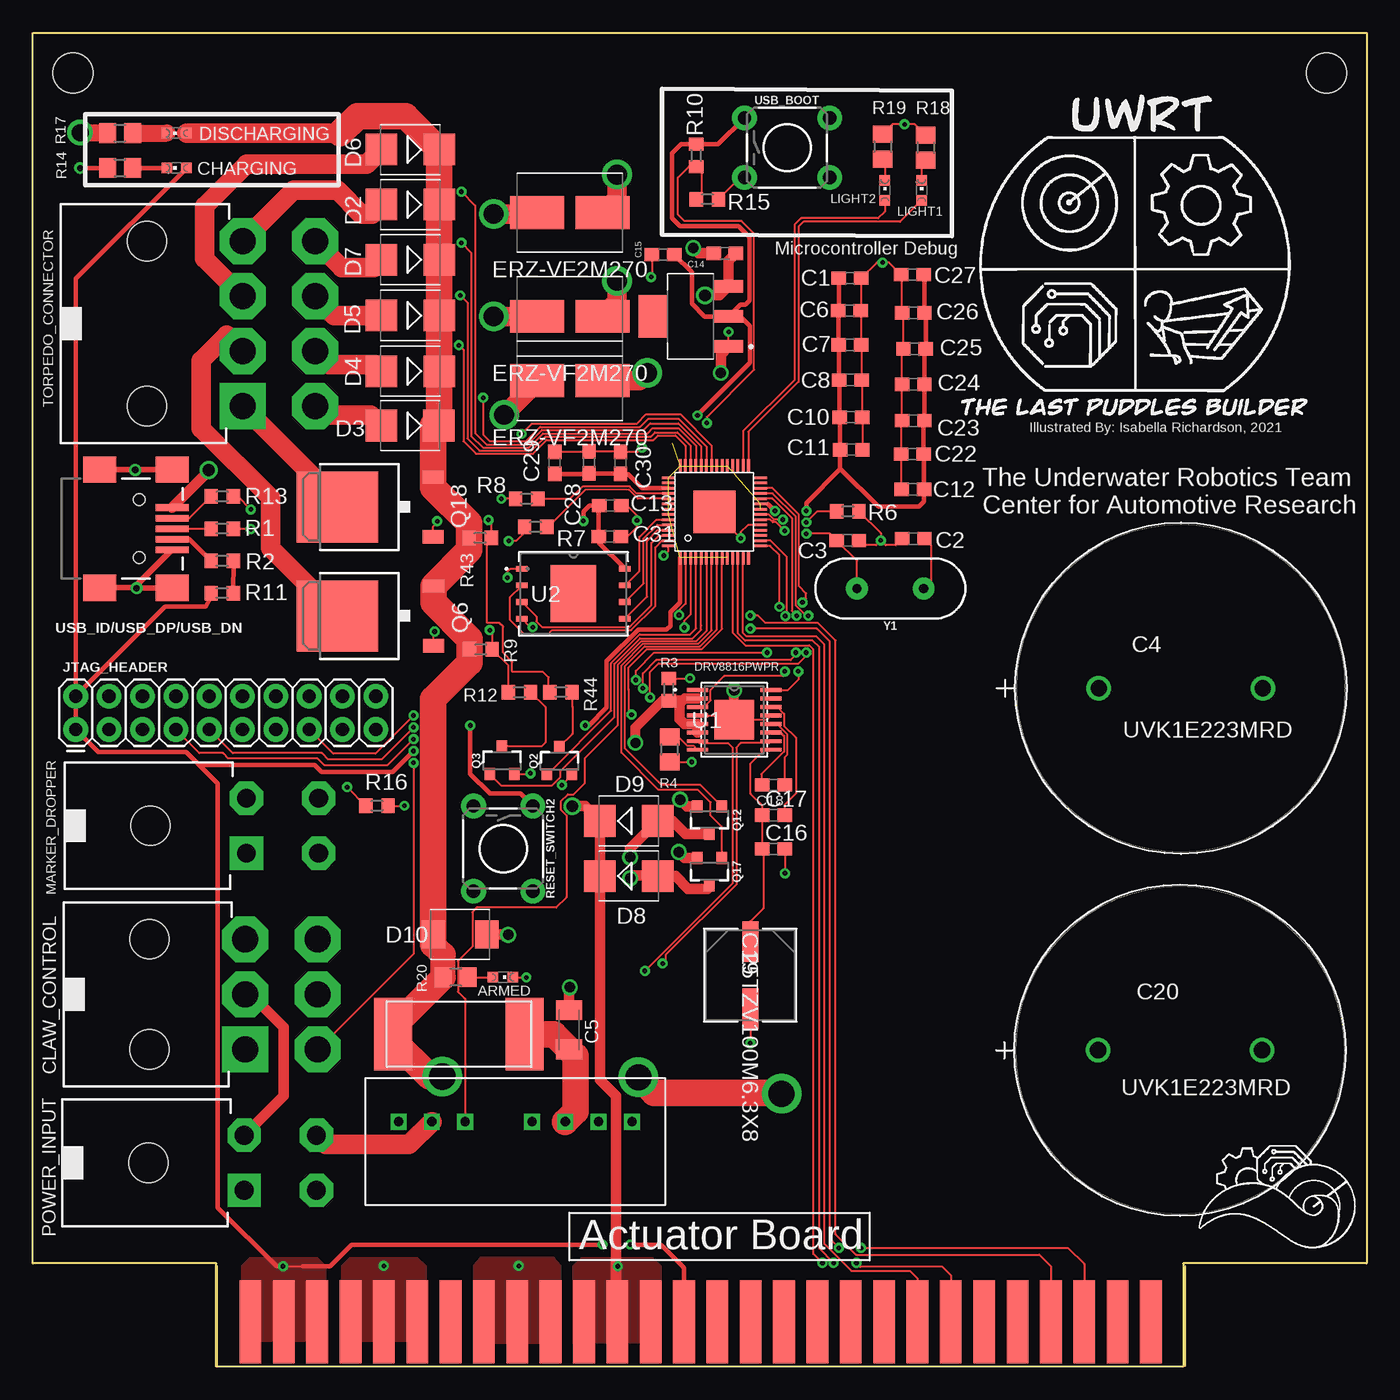
[diagram p2: board, top side]
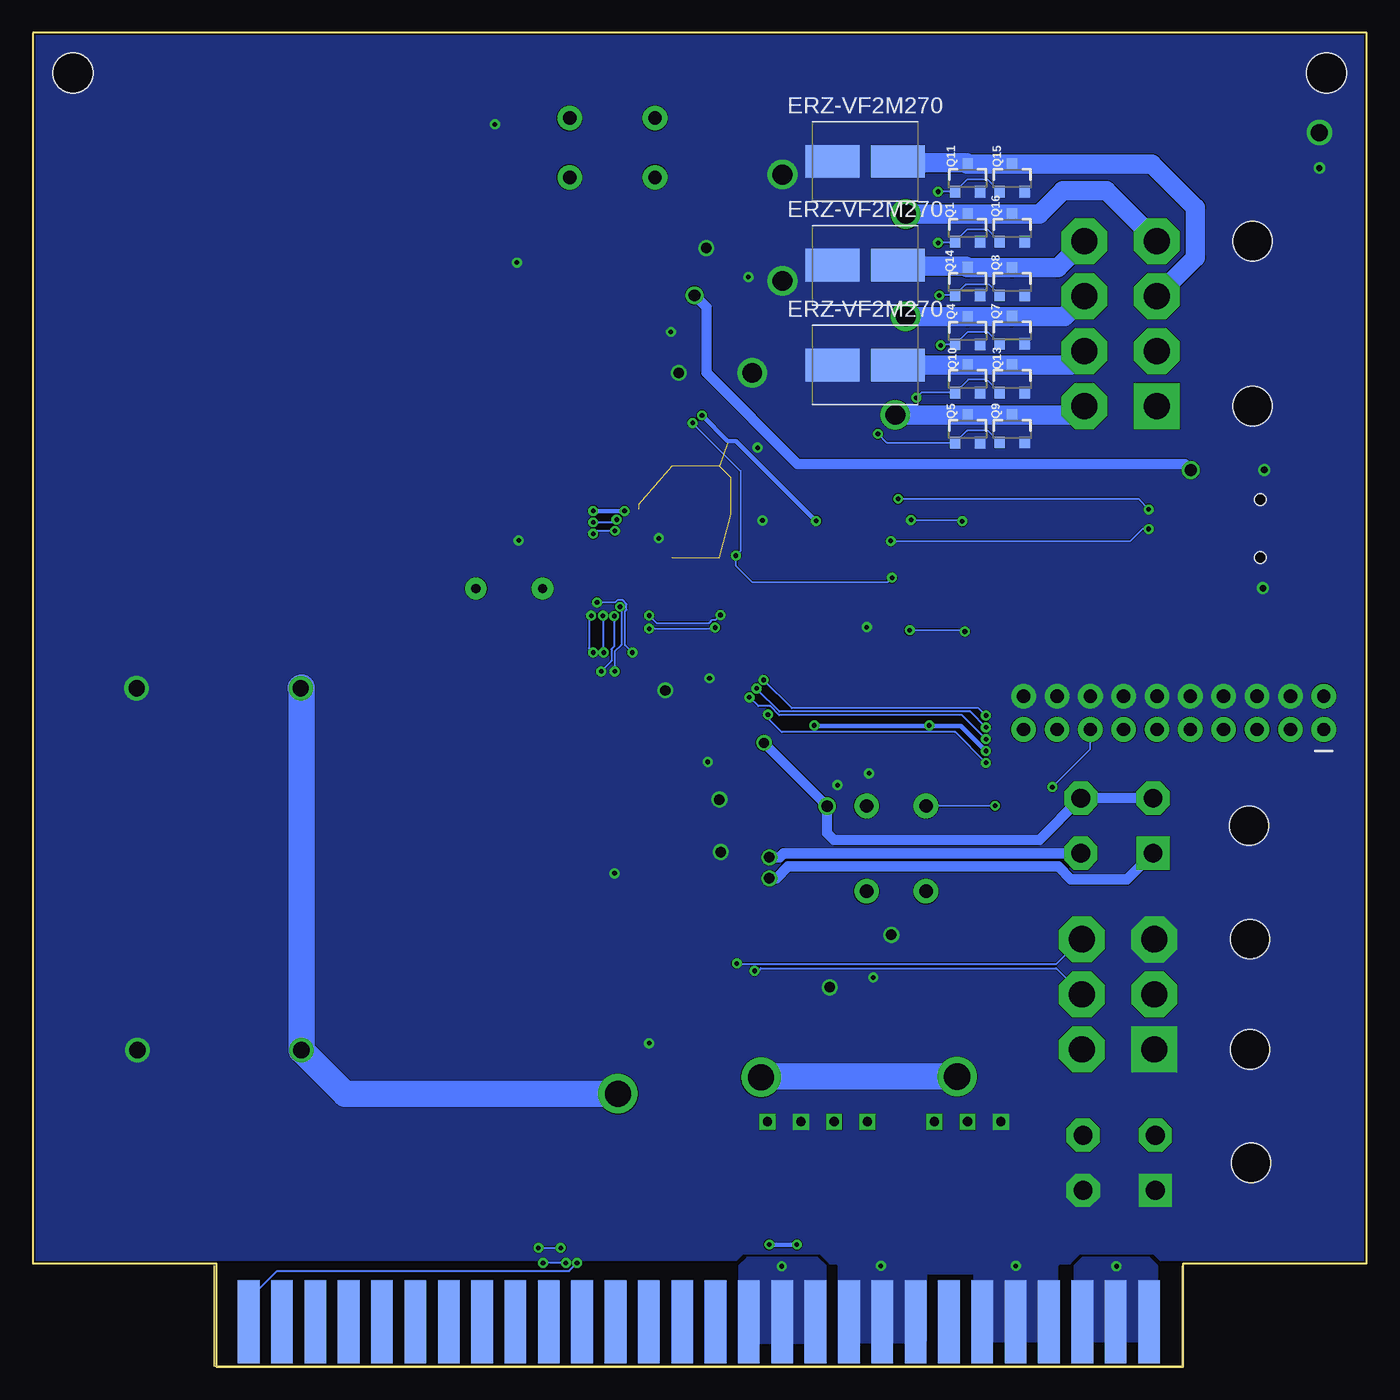
[diagram p3: board, bottom side, seen from below]

Size 101.6 x 101.6 mm. Coordinates in mm from the lower left corner, seen from the top.
Outline: 13.97,0 13.97,7.87 0,7.87 0,101.6 101.6,101.6 101.6,7.87 87.63,7.87 87.63,0 13.97,0
Copper layers (1*16): Top 0.035mm / dielectric 1.5mm / Bottom 0.035mm
Design rules "default *": minimum track width 6mil, minimum drill 0.35mm, track to track 2mil, track to pad 2mil, pad to pad 2mil, via to via 2mil, smd to smd 2mil, copper to edge 0mil, drill to drill 6mil, minimum pad ring 10mil, minimum via ring 8mil, stop-mask expansion 4mil, vias tented up to drill 0mil, thermal gap 10mil
Holes 3.05 mm at 3.05,98.55 98.55,98.55

### Footprints (pad centres in the part's own frame; a part is rotated, then mirrored left to right if it is on the bottom)
3550120RJT = smd 2.896 x 5.499: P$1 -5,0; P$2 5,0
CHIPLED_0603 = smd 0.8 x 0.8: A 0,-0.75; C 0,0.75
C0603 = smd 1.1 x 1: 1 -0.85,0; 2 0.85,0
CAP_UFW_25X50_NCH = drill 1.245 pad 1.753: 1 0,0; 2 12.497,0
C1206K = smd 1.5 x 2: 1 -1.5,0; 2 1.5,0
CAP_J-V_6P3X8_RUB = smd 3.099 x 1.219: 1 -2.553,0; 2 2.553,0
39-30-?06? = drill 2 pad 3.5 square: 1 4.191,0 | drill 2 pad 3.5 octagon: 2 0,0; 3 -4.191,0; 4 4.191,5.512; 5 0,5.512; 6 -4.191,5.512 | hole 3: -4.191,-7.3; 4.191,-7.3
SMB = smd 2.4 x 2.4: A 2.2,0; C -2.2,0
SMBJ = smd 1.78 x 2.16: A 2.04,0; C -2.03,0
2X10 = drill 1.016 pad 1.88: 1 0,0; 2 0,2.54; 3 2.54,0; 4 2.54,2.54; 5 5.08,0; 6 5.08,2.54; 7 7.62,0; 8 7.62,2.54; 9 10.16,0; 10 10.16,2.54; 11 12.7,0; 12 12.7,2.54; 13 15.24,0; 14 15.24,2.54; 15 17.78,0; 16 17.78,2.54; 17 20.32,0; 18 20.32,2.54; 19 22.86,0; 20 22.86,2.54
39-30-?04? = drill 1.422 pad 2.54 square: 1 2.095,0 | drill 1.422 pad 2.54 octagon: 2 -2.095,0; 3 2.095,5.512; 4 -2.095,5.512 | hole 3: 0,-7.3
SOT23-3 = smd 0.8 x 0.9: 1 -0.95,-1; 2 0.95,-1; 3 0,1.1
TO252 = smd 1 x 1.6: 1 -2.28,-4.8; 2 2.28,-4.8 | smd 5.4 x 6.2: 3 0,2.5
R0603 = smd 1 x 1.1: 1 -0.85,0; 2 0.85,0
R0805 = smd 1.3 x 1.5: 1 -0.95,0; 2 0.95,0
TACTILE_SWITCH_PTH_6.0MM = drill 1.016 pad 1.88: 1 -3.251,2.261; 2 3.251,2.261; 3 -3.251,-2.261; 4 3.251,-2.261
39-30-?08? = drill 2 pad 3.5 square: 1 6.287,0 | drill 2 pad 3.5 octagon: 2 2.095,0; 3 -2.095,0; 4 -6.287,0; 5 6.287,5.512; 6 2.095,5.512; 7 -2.095,5.512; 8 -6.287,5.512 | hole 3: -6.287,-7.3; 6.287,-7.3
PWP_16 = smd 1.6 x 0.3: 1 -2.8,2.275; 2 -2.8,1.625; 3 -2.8,0.975; 4 -2.8,0.325; 5 -2.8,-0.325; 6 -2.8,-0.975; 7 -2.8,-1.625; 8 -2.8,-2.275; 9 2.8,-2.275; 10 2.8,-1.625; 11 2.8,-0.975; 12 2.8,-0.325; 13 2.8,0.325; 14 2.8,0.975; 15 2.8,1.625; 16 2.8,2.275 | smd 3 x 3: EPAD 0,0
WIN_E-8_WIN = smd 0.864 x 0.432: 1 -3.924,1.905; 2 -3.924,0.635; 3 -3.924,-0.635; 4 -3.924,-1.905; 5 3.924,-1.905; 6 3.924,-0.635; 7 3.924,0.635; 8 3.924,1.905 | smd 3.454 x 4.343: 9 0,0
5530843-6-BOARDFINGERS = smd 1.651 x 6.35 bottom: 1 0.826,3.375; 2 3.365,3.375; 3 5.905,3.375; 4 8.445,3.375; 5 10.986,3.375; 6 13.525,3.375; 7 16.066,3.375; 8 18.605,3.375; 9 21.145,3.375; 10 23.686,3.375; 11 26.226,3.375; 12 28.765,3.375; 13 31.305,3.375; 14 33.846,3.375; 15 36.386,3.375; 16 38.925,3.375; 17 41.465,3.375; 18 44.005,3.375; 19 46.545,3.375; 20 49.086,3.375; 21 51.626,3.375; 22 54.166,3.375; 23 56.706,3.375; 24 59.245,3.375; 25 61.785,3.375; 26 64.326,3.375; 27 66.865,3.375; 28 69.406,3.375 | smd 1.651 x 6.35: 29 69.406,3.375; 30 66.865,3.375; 31 64.326,3.375; 32 61.785,3.375; 33 59.245,3.375; 34 56.706,3.375; 35 54.166,3.375; 36 51.626,3.375; 37 49.086,3.375; 38 46.545,3.375; 39 44.005,3.375; 40 41.465,3.375; 41 38.925,3.375; 42 36.386,3.375; 43 33.846,3.375; 44 31.305,3.375; 45 28.765,3.375; 46 26.226,3.375; 47 23.686,3.375; 48 21.145,3.375; 49 18.605,3.375; 50 16.066,3.375; 51 13.525,3.375; 52 10.986,3.375; 53 8.445,3.375; 54 5.905,3.375; 55 3.365,3.375; 56 0.826,3.375
RESM8060X320N = smd 4.11 x 2.5: 1 -2.495,0; 2 2.495,0
TMR6-2415 = drill 0.7 square: P$1 0,0; P$2 2.54,0; P$3 5.08,0; P$5 10.16,0; P$6 12.7,0; P$7 15.24,0; P$8 17.78,0
RP2040 = smd 3.2 x 3.2: GND 0,0 | smd 1 x 0.2: P$1 -3.5,2.6; P$2 -3.5,2.2; P$3 -3.5,1.8; P$4 -3.5,1.4; P$5 -3.5,1; P$6 -3.5,0.6; P$7 -3.5,0.2; P$8 -3.5,-0.2; P$9 -3.5,-0.6; P$10 -3.5,-1; P$11 -3.5,-1.4; P$12 -3.5,-1.8; P$13 -3.5,-2.2; P$14 -3.5,-2.6; P$29 3.5,-2.6; P$30 3.5,-2.2; P$31 3.5,-1.8; P$32 3.5,-1.4; P$33 3.5,-1; P$34 3.5,-0.6; P$35 3.5,-0.2; P$36 3.5,0.2; P$37 3.5,0.6; P$38 3.5,1; P$39 3.5,1.4; P$40 3.5,1.8; P$41 3.5,2.2; P$42 3.5,2.6 | smd 0.2 x 1: P$15 -2.6,-3.5; P$16 -2.2,-3.5; P$17 -1.8,-3.5; P$18 -1.4,-3.5; P$19 -1,-3.5; P$20 -0.6,-3.5; P$21 -0.2,-3.5; P$22 0.2,-3.5; P$23 0.6,-3.5; P$24 1,-3.5; P$25 1.4,-3.5; P$26 1.8,-3.5; P$27 2.2,-3.5; P$28 2.6,-3.5; P$43 2.6,3.5; P$44 2.2,3.5; P$45 1.8,3.5; P$46 1.4,3.5; P$47 1,3.5; P$48 0.6,3.5; P$49 0.2,3.5; P$50 -0.2,3.5; P$51 -0.6,3.5; P$52 -1,3.5; P$53 -1.4,3.5; P$54 -1.8,3.5; P$55 -2.2,3.5; P$56 -2.6,3.5
USB-MINIB = smd 2.5 x 0.5: D+ 2.5,0; D- 2.5,0.8; GND 2.5,-1.6; ID 2.5,-0.8; VBUS 2.5,1.6 | smd 2.5 x 2: S1 -3,4.5; S2 2.5,4.5; S3 -3,-4.5; S4 2.5,-4.5 | hole 0.9: 0,2.2; 0,-2.2
VREG_LM1117IMPX-3.3/NOPB = smd 2.15 x 0.95: 1 -2.9,2.3; 2 -2.9,0; 3 -2.9,-2.3 | smd 2.15 x 3.25: 4 2.9,0
HC49US = drill 0.7 pad 1.651: 1 -2.54,0; 2 2.54,0

### Placement (x,y rotation side)
120  32.46,25.33 180 top
ARMED  35.81,29.66 270 top
C1  62.24,82.91 0 top
C2  67.06,63.07 180 top
C3  62.08,62.94 0 top
C4  81.2,51.68 0 top
C5  40.85,25.67 90 top
C6  62.21,80.44 0 top
C7  62.24,77.83 0 top
C8  62.28,75.15 0 top
C10  62.31,72.31 0 top
C11  62.34,69.84 0 top
C12  67.03,66.83 180 top
C13  43.98,65.58 0 top
C14  52.7,84.8 180 top
C15  48,84.7 180 top
C16  56.41,39.43 0 top
C17  56.41,42 0 top
C18  56.41,44.31 180 top
C19  54.65,29.82 270 top
C20  81.13,24.1 0 top
C22  67,69.51 180 top
C23  67.06,72.05 180 top
C24  67.06,74.82 180 top
C25  67.16,77.53 180 top
C26  67.06,80.27 180 top
C27  67,83.18 180 top
C28  42.36,68.88 90 top
C29  39.76,68.85 90 top
C30  44.78,68.85 90 top
C31  43.95,63.23 0 top
CHARGING  10.95,91.31 90 top
CLAW_CONTROL  39-30-06?  [39-30-?06?]  16.18,28.36 270 top
D2  28.76,88.51 180 top
D3  28.74,71.68 180 top
D4  28.76,75.82 180 top
D5  28.75,80.08 180 top
D6  28.76,92.71 180 top
D7  28.76,84.32 180 top
D8  45.4,37.36 0 top
D9  45.4,41.57 0 top
D10  32.53,32.93 0 top
DISCHARGING  10.95,93.96 90 top
JTAG_HEADER  3.27,48.53 0 top
LIGHT1  67.7,89.6 0 top
LIGHT2  64.9,89.6 0 top
MARKER_DROPPER  39-30-04?  [39-30-?04?]  16.26,41.2 270 top
POWER_INPUT  39-30-04?  [39-30-?04?]  16.1,15.53 270 top
Q1  30.4,86.7 0 bottom
Q2  40.11,46.12 0 top
Q3  35.74,46.14 0 top
Q4  30.4,78.87 0 bottom
Q5  30.4,71.39 0 bottom
Q6  25.71,57.19 90 top
Q7  27,78.9 0 bottom
Q8  27,82.6 0 bottom
Q9  27,71.4 0 bottom
Q10  30.4,75.2 0 bottom
Q11  30.4,90.5 0 bottom
Q12  51.54,41.68 180 top
Q13  27,75.21 0 bottom
Q14  30.4,82.61 0 bottom
Q15  27,90.5 0 bottom
Q16  27,86.7 0 bottom
Q17  51.54,37.74 180 top
Q18  25.7,65.49 90 top
R1  14.43,63.84 0 top
R2  14.43,58.92 180 top
R3  48.44,51.58 270 top
R4  48.51,47.02 90 top
R6  62.08,65.15 0 top
R7  38.3,63.96 0 top
R8  37.61,66.11 0 top
R9  34.12,54.64 180 top
R10  50.52,92.26 90 top
R11  14.43,61.38 0 top
R12  37.07,51.36 180 top
R13  14.43,66.3 0 top
R14  6.64,91.31 0 top
R15  51.38,88.92 0 top
R16  26.22,42.73 0 top
R17  6.64,93.96 0 top
R18  68.02,92.85 270 top
R19  64.73,92.92 270 top
R20  32.22,29.67 180 top
R43  34.07,63.14 180 top
R44  40.23,51.39 180 top
RESET_SWITCH2  35.83,39.46 270 top
TORPEDO_CONNECTOR  39-30-08?  [39-30-?08?]  15.99,79.45 270 top
U1  53.43,49.27 0 top
U2  41.18,58.87 0 top
U$1  15.76,0.05 0 top
U$2  40.9,87.9 180 top
U$3  38.2,91.8 0 bottom
U$4  38.2,76.3 0 bottom
U$5  40.9,75.1 180 top
U$6  27.86,18.66 0 top
U$7  38.2,83.9 0 bottom
U$8  40.9,80 180 top
U$9  51.91,65.12 90 top
USB_BOOT  57.45,92.85 0 top
USB_ID/USB_DP/USB_DN  8.1,63.84 0 top
VR1  50.1,80 180 top
Y1  65.31,59.27 180 top

### Tracks (layer width: path | path; a pad name or v marks a point on that pad's centre or on a via)
+3V3  (via drill 0.35)  (12 unrouted)
  Top 0.152: 13.58,58.64 R2.2 | U$1.43 49.61,3.44 | VR1.2 53.9,80 | v19.06,7.65 20.54,7.65 | 56,65.71 U$9.P$23 | C13.1 43.1,65.55 | 43.1,62.78 C31.1 | 61.39,80.47 C6.1 | 61.36,77.86 C7.1 | 61.39,75.19 C8.1 61.46,75.12 | C10.1 61.49,72.28 | 67.88,69.47 C22.1 | 67.85,71.98 C23.1 | 67.91,77.43 C25.1 | 68.01,80.17 C26.1 | 67.91,83.11 C27.1 | 61.49,68.36 61.49,68.42 | 42.33,68 C28.1 | 44.74,68.03 C30.1
  Top 0.35: v29,46.9 27.4,45.3 22,45.3 21.47,45.83 12.67,45.83 | 12.67,45.83 11.67,46.83 4.97,46.83 JTAG_HEADER.1 JTAG_HEADER.2 | JTAG_HEADER.2 10.1,57.9 13.15,57.9 13.58,58.64 | v19.06,7.65 18.56,7.65 14.09,12.11 14.09,44.41 12.67,45.83 | 49.61,3.44 49.61,7.55 47.87,9.3 v45.5,9.3 | 20.54,7.65 22.65,7.65 24.3,9.3 v43.4,9.3 | C15.1 50.2,83.35 50.2,80.97 51.17,80 VR1.2 | v50.63,72.46 54.63,76.47 54.63,79.27 53.9,80 | JTAG_HEADER.2 3.27,82.87 CHARGING.A | 61.49,68.36 58.91,65.78 v58.91,65.18 | v56.53,65.18 56,65.71 | v42.07,48.84 42.36,48.84 43.72,50.2 43.72,53.73 46.12,56.13 48.27,56.13 48.57,56.43 48.57,57.49 49.31,58.22 U$9.P$1 | v41.94,64.42 41.94,65.11 42.4,65.58 C13.1 | 43.1,65.55 C31.1 | U2.8 43.1,62.78 | USB_BOOT.1 52.2,93.11 R10.2 49.39,93.11 48.7,92.42 48.7,87.47 49.3,86.88 53.76,86.88 54.58,86.05 54.58,81.2 54.28,80.9 53.9,80.9 VR1.2 | C1.1 61.39,80.47 | C6.1 61.36,77.86 | C7.1 61.39,75.19 | 61.46,75.12 C10.1 | 61.49,72.28 C11.1 61.49,68.42 64.4,65.51 67.49,65.51 67.88,65.9 C12.1 67.88,69.47 | C22.1 67.85,71.98 | C23.1 C24.1 67.91,77.43 | C25.1 68.01,80.17 | C26.1 67.91,83.11 | RESET_SWITCH2.1 37.15,43.65 34.83,43.65 33.32,45.16 v33.32,48.84 | C30.1 45.33,68 46.41,66.92 U$9.P$45 | C29.1 42.33,68 | C28.1 44.74,68.03
  Bottom 0.152: v42.07,48.84 42.03,48.8 | 48.67,70.5 48.67,70.37 | v41.95,64.42 v41.94,64.42 | 33.32,48.8 v33.32,48.84
  Bottom 0.35: 42.03,48.8 33.32,48.8 30.9,48.8 v29,46.9 | v45.5,9.3 v43.4,9.3 | v56.53,65.18 v58.91,65.18 | v50.63,72.46 48.67,70.5 48.03,70.5 v41.95,64.42
  pour Bottom (no thermals): 15.93,7.67 16.57,8.3 21.65,8.3 22.28,7.67 22.28,1.95 15.93,1.95
  pour Top (no thermals): 15.93,7.67 16.57,8.3 21.65,8.3 22.28,7.67 22.28,1.95 15.93,1.95
+5V  (via drill 0.35, 0.77, 0.9)
  Top 0.775: R3.2 47.95,50.73 45.9,48.68 v45.9,47.52
  Top 0.8: U$1.12 44.42,3.52 44.42,20.63 43.2,21.86 D8.C D9.C 42.07,42.7 v41.09,42.7 | U1.2 50.61,50.91 49.67,50.91 49.49,50.73 | R3.2 49.49,50.73 | 49.49,50.73 49.26,50.5 49.26,49.34 49.64,48.96 50.61,48.96 U1.5 U1.6
  Bottom 0.775: v41.09,42.7 45.9,47.5 v45.9,47.52 | v45.9,47.52
  Bottom 0.8: MARKER_DROPPER.2 MARKER_DROPPER.4 24.94,40.13 40.58,40.13 41.09,40.65 v41.09,42.7
  other vias: 44.56,7.65
  pour Top (no thermals): 41.2,1.83 41.2,7.67 41.84,8.3 47.17,8.3 47.81,7.67 47.81,1.83
  pour Bottom (no thermals): 41.2,1.83 41.2,7.67 41.84,8.3 47.17,8.3 47.81,7.67 47.81,1.83
+12V
  Top 0.8: POWER_INPUT.2 19.09,20.62 19.09,25.85 16.58,28.36 CLAW_CONTROL.2
+24V  (via drill 2)
  Top 1.5: 30.5,71.72 30.98,71.72 D3.C | 30.94,75.8 D4.C | 30.96,80.07 D5.C | D7.C | DISCHARGING.A 23.42,93.96
  Top 1.905: 30.5,32.15 31.27,31.38 R20.2 27.46,25.86 120.P$2 27.46,24.86
  Top 2: 30.5,71.72 Q18.2 30.5,66.97 33.22,64.25 R43.2 33.22,62.18 Q6.2 30.51,58.2 33.27,55.44 R9.2 33.27,53.64 30.5,50.87 D10.C 30.5,32.15 | D3.C 30.94,75.8 | D4.C 30.96,80.07 | D5.C D7.C | D7.C D2.C D6.C 28.41,95.27 24.72,95.27 23.42,93.96 | v57.03,20.79 56.97,20.85 47.32,20.85 v46.13,22.04 | v31.2,22.1 30.22,22.1 27.46,24.86
  Bottom 2: v46.13,22.04 46.07,22.1 v31.2,22.1 | v57.03,20.79 77.81,20.79 C20.1 81.13,51.74 C4.1
AGND  (via drill 0.35, 0.45, 0.5, 0.77, 0.8, 1.3, 1.5)
  Top 0.152: R19.1 65.49,94.63 v66.4,94.63 67.19,94.63 R18.1 | Q3.2 37.84,45.14 v37.9,45.2 | Q2.2 41.06,45.06 v40.3,44.3 | 40.85,28.85 v40.9,28.9 | ARMED.C 37.57,29.66 v37.59,29.64 | 36.17,32.93 v36.2,32.9 | C15.2 47.15,83.05 v47.1,83 | R3.1 50.05,52.43 v50.06,52.44 | R4.1 v50.18,46.07 v50.19,46.06 | C16.2 57.29,39.4 v57.29,37.58 | C19.2 v54.65,24.63 | U1.13 55.9,49.27 U1.EPAD 53.1,49.59 U1.4 | 63.09,80.47 C6.2 63.09,80.4 | 63.06,77.86 C7.2 | C11.2 63.19,72.28 C10.2 63.16,75.12 C8.2 63.13,77.8 C7.2 | VR1.1 v53,78.82 | 66.18,66.85 C12.2 66.18,69.47 C22.2 66.15,71.98 C23.2 C24.2 66.21,77.43 C25.2 66.31,80.17 C26.2 66.21,83.11 C27.2 66.14,83.18 65.22,84.1 v64.72,84.1 64.28,84.1 C1.2 63.09,80.4 | 63.09,80.4 C7.2 | R6.2 64.59,63.49 v64.59,62.94 | C3.2 63.29,62.57 64.22,62.57 v64.59,62.94 | v64.59,62.94 64.95,62.57 65.72,62.57 C2.2 | C31.2 45.3,63.23 46.02,63.96 v46.02,64.45 46.02,64.82 45.26,65.58 C13.2 | U$9.GND v53.92,63.1 | v53.92,63.1 | U$9.P$19 54.49,64.11 54.48,64.12 53.92,63.56 v53.92,63.1 | U2.4 37.89,56.33 v38.07,56.33 | C29.2 42.33,69.7 C28.2 44.74,69.73 C30.2 46.09,69.7 v46.39,70
  Top 0.35: R14.1 v3.61,91.31 v3.6,91.3
  Top 0.4: USB_ID/USB_DP/USB_DN.GND 7.9,59.53 v7.9,59.3
  Top 0.406: USB_ID/USB_DP/USB_DN.S1 7.76,68.34 | 7.76,68.34 v7.8,68.3 | USB_ID/USB_DP/USB_DN.S2 7.76,68.34 | USB_ID/USB_DP/USB_DN.S3 7.86,59.34 v7.9,59.3 10.57,59.3 USB_ID/USB_DP/USB_DN.S4
  Top 0.775: U1.EPAD v53.43,51.51 | v53.43,51.51
  Top 0.8: Q17.2 49.66,38.74 v49.2,39.2 | C5.2 40.85,28.85 | D10.A 36.17,32.93 | Q12.2 49.82,42.68 v49.3,43.2 | C14.2 50.7,84.8 v50.3,85.2 | VR1.1 52.4,77.1 v52.4,75.7
  Top 1.3: R17.1 3.64,93.96 v3.6,94
  Top 1.5: U$2.1 44.5,89 v44.5,90.8 | U$8.1 44.5,81.11 v44.5,82.7 | U$5.1 46.2,75.1 v46.8,75.7
  other vias: 26.73,7.67 37.01,7.67
  pour Top (no thermals): 23.55,7.67 24.19,8.3 29.27,8.3 29.9,7.67 29.9,1.95 23.55,1.95
  pour Bottom (no thermals): 23.55,7.67 24.19,8.3 29.27,8.3 29.9,7.67 29.9,1.95 23.55,1.95
  pour Top (no thermals): 33.71,1.83 40.19,1.83 40.19,7.67 39.68,8.3 34.09,8.3 33.58,7.67 33.58,1.95
  pour Bottom (no thermals): 33.58,7.67 33.58,1.95 33.71,1.83 40.06,1.83 40.06,5.76 40.19,5.89 40.19,7.67 39.68,8.3 34.09,8.3
  pour Bottom (rank 3, no thermals): 0.25,101.35 101.35,101.35 101.35,8.13 48.01,8.13 47.5,8.64 41.66,8.64 40.89,7.87 40.39,7.87 39.62,7.11 24.13,7.11 23.37,7.87 22.61,7.87 21.84,8.64 16.26,8.64 15.75,8.13 0.25,8.13
ARM_TORPEDO
  Top 0.152: U$6.P$3 32.94,28.02 32.39,28.56 32.39,30.9 33.48,32 33.48,34.64 33.81,34.97 39.85,34.97 40.65,35.76 40.65,42 40.2,42.45 40.2,43.04 40.76,43.6 41.2,43.6 42.05,44.45 42.05,46.35 44.57,48.87 44.57,53.48 46.37,55.27 50.54,55.27 51.3,56.03 51.3,61.61 U$9.P$6
COIL_1  (via drill 1.5)
  Top 1.5: D5.A 22.96,80.08 TORPEDO_CONNECTOR.7 | v35.1,80 U$8.2
  Bottom 1.5: TORPEDO_CONNECTOR.7 23.04,80 Q7.3 27.03,79.97 Q4.3 35.07,79.97 v35.1,80
COIL_1_GATE  (via drill 0.35)
  Top 0.152: v32.45,77.8 32.8,77.45 32.8,70.5 33.76,69.54 38.1,69.54 39.15,70.58 47.27,70.58 47.62,70.93 48.94,70.93 49.71,70.16 U$9.P$41
  Bottom 0.152: Q7.1 28.85,78.8 30.42,78.8 Q4.1 32.38,77.87 v32.45,77.8
COIL_2
  Top 1.5: D7.A 25.96,83.72 23.51,83.72 TORPEDO_CONNECTOR.8
  Bottom 1.5: TORPEDO_CONNECTOR.8 23.53,83.7 Q8.3 Q14.3 30.51,83.82 35.63,83.82 U$7.2
COIL_2_GATE  (via drill 0.35)
  Top 0.152: v32.55,81.6 33.1,81.05 33.1,70.7 34.03,69.77 37.97,69.77 39.06,70.86 47.09,70.86 47.38,71.16 49.09,71.16 50.11,70.14 U$9.P$40
  Bottom 0.152: Q8.1 28.75,82.4 30.56,82.4 Q14.1 v32.55,81.6
COIL_3  (via drill 1.5)
  Top 1.5: D3.A 25.74,72.48 22.18,72.48 TORPEDO_CONNECTOR.5 | U$5.2 38.41,75 v35.9,72.5
  Bottom 1.5: TORPEDO_CONNECTOR.5 22.16,72.5 Q9.3 Q5.3 | Q5.3 | Q5.3 v35.9,72.5
COIL_3_GATE  (via drill 0.35)
  Top 0.152: v37.23,71.06 37.98,71.81 45.99,71.81 46.72,72.55 49.32,72.55 51.71,70.15 U$9.P$36
  Bottom 0.152: Q9.1 28.85,71.3 30.44,71.3 Q5.1 36.56,70.39 v37.23,71.06
COIL_4
  Top 1.5: D4.A 26.06,76.32 22.53,76.32 TORPEDO_CONNECTOR.6
  Bottom 1.5: TORPEDO_CONNECTOR.6 22.54,76.31 Q13.3 Q10.3 U$4.2
COIL_4_GATE  (via drill 0.35)
  Top 0.152: v34.3,73.8 34.3,71 34.8,70.5 37.58,70.5 38.65,71.57 46.24,71.57 46.89,72.22 49.19,72.22 51.31,70.1 U$9.P$37
  Bottom 0.152: Q13.1 28.94,75.2 30.35,75.2 Q10.1 33.9,74.2 v34.3,73.8
COIL_5
  Top 1.5: D6.A 25.44,91.6 16.3,91.6 13.1,88.4 13.1,84.4 15.96,81.54 TORPEDO_CONNECTOR.3
  Bottom 1.5: TORPEDO_CONNECTOR.3 15.97,81.54 13.04,84.48 13.04,88.29 16.35,91.6 Q15.3 Q11.3 30.5,91.7 35.6,91.7 U$3.2
COIL_5_GATE  (via drill 0.35)
  Top 0.152: v32.65,89.5 33.7,88.45 33.7,71.1 34.57,70.23 37.68,70.23 38.78,71.34 46.51,71.34 46.84,71.68 | 46.84,71.68 46.85,71.68 | 46.84,71.68 47.02,71.85 49.17,71.85 50.91,70.11 U$9.P$38
  Bottom 0.152: Q15.1 28.85,90.4 30.45,90.4 Q11.1 v32.65,89.5
COIL_S  (via drill 1.5)
  Top 1.5: D2.A 25.85,87.8 25,87.8 23.2,89.6 19.85,89.6 TORPEDO_CONNECTOR.4 | v35.1,87.8 38.3,87.8 U$2.2
  Bottom 1.5: TORPEDO_CONNECTOR.4 19.84,89.58 23.15,89.58 24.94,87.8 Q16.3 Q1.3 v35.1,87.8
COIL_S_GATE  (via drill 0.35)
  Top 0.152: v32.65,85.6 33.4,84.85 33.4,70.9 34.28,70.02 37.79,70.02 38.87,71.09 46.82,71.09 47.22,71.49 49.18,71.49 50.51,70.16 U$9.P$39
  Bottom 0.152: Q16.1 28.85,86.6 30.45,86.6 Q1.1 31.45,85.6 v32.65,85.6
DROPPER1  (via drill 0.8)
  Top 0.8: Q17.3 51.54,36.54 51.4,36.4 49.9,36.4 48.94,37.36 D8.A 47.56,37.4 45.7,37.4 v45.5,37.2
  Bottom 0.8: v45.5,37.2 44.97,37.2 44.08,38.09 23.49,38.09 22.52,37.11 18.25,37.11 MARKER_DROPPER.1
DROPPER1_GATE
  Top 0.152: Q17.1 52.49,41.11 51.62,41.98 51.62,42.98 50.67,43.94 47.66,43.94 44.83,46.77 44.83,53.4 46.49,55.07 50.69,55.07 51.7,56.08 51.7,61.61 U$9.P$7
DROPPER2  (via drill 0.8)
  Top 0.8: Q12.3 49.72,40.58 48.73,41.57 D9.A 45.5,39.47 v45.5,38.8
  Bottom 0.8: v45.5,38.8 44.74,38.8 44.43,39.11 MARKER_DROPPER.3
DROPPER2_GATE
  Top 0.152: Q12.1 50.84,44.34 47.86,44.34 45.09,47.1 45.09,53.35 46.61,54.86 50.81,54.86 52.1,56.16 52.1,61.61 U$9.P$8
EXTRA1  (via drill 0.35)
  Top 0.152: v60.15,7.9 | v60.15,7.9 59.46,8.59 59.46,54.63 59.14,54.95 54.27,54.95 53.31,55.91 U$9.P$11
  Bottom 0.152: U$1.28 85.16,5.14 83,7.3 60.75,7.3 v60.15,7.9
EXTRA5
  Top 0.152: U$1.36 67.38,6.72 66.8,7.3 62.35,7.3 60.3,9.35 60.3,55.01 59.68,55.62 54.35,55.62 54.33,55.64 54.11,55.87 U$9.P$13
EXTRA6  (via drill 0.35)
  Top 0.152: U$1.35 69.92,6.96 69.28,7.6 63.04,7.6 v62.74,7.9 | v61,7.9 59.9,9 59.9,54.81 59.4,55.31 54.26,55.31 53.71,55.86 U$9.P$12
  Bottom 0.152: v61,7.9 v62.74,7.9
LED1
  Top 0.152: LIGHT1.A 66.06,87.21 58.69,87.21 58.33,86.85 58.33,75.03 54.51,71.21 U$9.P$29
LED2
  Top 0.152: LIGHT2.A 64.9,87.99 64.39,87.48 58.53,87.48 58.02,86.98 58.02,75.16 54.11,71.25 U$9.P$30
N$2
  Top 0.152: C2.1 68.41,62.57 68.41,59.83 Y1.1
N$3  (via drill 0.35)
  Top 0.152: v58.91,63.45 60.71,63.45 C3.1 62.77,61.39 Y1.2 | v57.26,63.67 56.61,64.32 56.36,64.32 56.16,64.52 U$9.P$20
  Bottom 0.152: v58.91,63.45 58.69,63.67 v57.26,63.67
N$4
  Top 0.35: CHARGING.C R14.2
N$5  (via drill 0.35)
  Top 0.152: R6.1 59.74,65.15 v58.91,64.32 | U$9.P$21 55.41,64.91 56.06,64.91 56.45,64.52 v57.12,64.52
  Bottom 0.152: v58.91,64.32 57.33,64.32 v57.12,64.52
N$6
  Top 0.152: USB_ID/USB_DP/USB_DN.ID 11.92,63.04
  Top 0.35: 11.92,63.04 R11.1
N$7
  Top 0.152: USB_ID/USB_DP/USB_DN.D+ R1.1
N$8
  Top 0.152: USB_ID/USB_DP/USB_DN.D- 11.92,64.64 R13.1
N$10
  Top 0.152: R20.1 ARMED.A
N$11
  Top 0.152: R7.2 39.26,63.96 42.08,66.78 45.4,66.8 46.09,66.11 U$9.P$47
N$12
  Top 0.152: R8.2 40.94,66.11 41.87,67.04 45.47,67.04 46,66.52 U$9.P$46
N$15
  Top 1.3: R17.2 DISCHARGING.C
N$16
  Top 0.152: R18.2 67.7,91.59 LIGHT1.C
N$17
  Top 0.152: R19.2 64.9,91.8 LIGHT2.C
N$18
  Top 0.152: R15.2 53.9,90.59 USB_BOOT.3
N$19  (via drill 0.35)
  Top 0.152: R16.2 v28.3,42.73 | v28.3,42.73
  Bottom 0.152: v28.3,42.73 33.55,42.73 RESET_SWITCH2.3
N$26
  Top 1.5: C5.1 41.36,23.66
  Top 2: 41.36,23.66 41.36,19.46 U$6.P$6 | 120.P$1 39.69,25.33 C5.1
N$33  (via drill 0.35)
  Top 0.152: v30.8,64.4 30.8,64.31 30.5,64.01 Q18.1 | v34.7,64.5 34.92,64.28 R43.1 34.6,62.82 34.6,56.66 35.53,56.66 35.83,56.37 35.83,54.38 36.52,53.69 36.52,52.96 36.55,52.93 38.87,52.93 39.29,52.5 39.29,51.48 R44.2
  Bottom 0.152: v34.7,64.5 30.9,64.5 v30.8,64.4
N$34
  Top 0.152: Q2.3 41.09,48.21 41.09,50.27 41.08,50.29 R44.1
N$35  (via drill 0.35)
  Top 0.152: R12.2 36.22,53.39 R9.1 34.97,55.93 v34.8,56.1 | v30.6,56 30.5,55.9 Q6.1
  Bottom 0.152: v34.8,56.1 30.7,56.1 v30.6,56
N$36
  Top 0.152: R12.1 39.05,50.23 39.05,47.55 38.74,47.24 Q3.3
N$45
  Top 0.152: U1.8 50.32,47.3 49.84,47.3 49.17,47.97 R4.2
N$46
  Top 0.152: U1.14 56.72,50.23 57.22,49.73 57.22,48.81 58.12,47.91 58.12,43.66 57.27,42.8 C17.2
N$47
  Top 0.152: U1.9 55.71,46.99 54.67,45.95 54.67,43.63 55.56,42.74 C17.1 C16.1 55.65,39.34 55.65,34.92 54.65,33.92 C19.1
N$48
  Top 0.152: U1.11 56.97,48.29 57.22,48.04 57.22,46.85 55.49,45.13 55.49,44.38 C18.2
N$49
  Top 0.152: U1.12 56.72,48.93 57.46,48.19 57.46,46.6 57.27,46.41 C18.1
PWM_CLAW  (via drill 0.35)
  Top 0.152: 45.37,51.57 45.37,49.9 v45.6,49.67 | 45.39,51.59 45.37,51.57 | v29,46 29,31.43 21.74,24.17 CLAW_CONTROL.4 | U$9.P$9 52.5,61.61 52.5,56.2 50.96,54.66 46.78,54.66 45.37,53.25 45.37,51.57
  Bottom 0.152: v29,46 31.33,48.33 44.56,48.33 45.6,49.37 v45.6,49.67
PWM_DRIVER1  (via drill 0.35)
  Top 0.152: U1.3 51.11,50.24 51.62,50.75 51.62,51.55 52.66,52.59 57.15,52.59 57.28,52.72 v57.28,52.96 | v56.87,57.88 56.87,61.81 56.17,62.52 U$9.P$15
  Bottom 0.152: 57.28,53.38 57.28,54.46 56.77,54.97 56.77,57.78 v56.87,57.88 | 57.28,53.38 | v57.28,52.96 57.28,53.38
PWM_DRIVER2  (via drill 0.35)
  Top 0.152: v58.31,52.96 58.31,52.34 57.51,51.54 U1.16 | v57.31,57.18 57.39,57.26 57.39,61.71 56.19,62.91 U$9.P$16
  Bottom 0.152: v58.31,52.96 57.52,53.75 57.52,54.65 57.31,54.86 v57.31,57.18 | v57.31,57.18
PWM_OUT1  (via drill 0.35)
  Top 0.152: U1.7 50.77,47.5 52.97,47.5 53.28,47.18 53.28,36.81 v46.62,30.15
  Bottom 0.152: v46.62,30.15 46.35,30.15 46.15,30.34 23.64,30.34 21.69,28.4 CLAW_CONTROL.5
PWM_OUT2  (via drill 0.35)
  Top 0.152: U1.10 56.08,47.5 53.92,47.5 53.59,47.16 53.59,36.72 48.21,31.35 48.21,30.94 v47.98,30.71
  Bottom 0.152: CLAW_CONTROL.6 21.76,32.55 23.63,30.68 47.95,30.68 v47.98,30.71
QSPI_SCLK
  Top 0.152: U2.6 46.52,59.66 46.52,63.07 47.57,64.11 U$9.P$52
QSPI_SD0
  Top 0.152: U2.5 46.79,58.66 46.79,62.9 47.6,63.72 U$9.P$53
QSPI_SD1
  Top 0.152: U2.2 36.32,58.58 36.32,56.89 37.45,55.77 39.23,55.77 39.56,56.1 45.57,56.1 47.42,57.95 47.42,62.41 47.92,62.91 U$9.P$55
QSPI_SD2
  Top 0.152: U2.3 38.37,57.12 38.37,56.76 38.8,56.33 45.44,56.33 47.12,58.02 47.12,62.74 47.7,63.31 U$9.P$54
QSPI_SD3
  Top 0.152: U2.7 46.2,60.6 46.2,63.2 47.51,64.52 U$9.P$51
QSPI_SS  (via drill 0.35)
  Top 0.152: v51.35,71.89 51.35,72.35 54.95,75.95 54.95,86.31 53.99,87.27 49.63,87.27 49.13,87.77 49.13,90.57 49.97,91.41 R10.1 50.92,91.01 50.92,89.31 R15.1 | v36.16,60.1 36.16,60.56 36.38,60.78 U2.1 | v48.04,61.78 48.41,62.14 U$9.P$56
  Bottom 0.152: 51.08,71.89 v51.35,71.89 47.68,68.22 47.68,62.14 v48.04,61.78 48.04,60.99 46.82,59.77 36.45,59.77 36.16,60.06 v36.16,60.1
RESET  (via drill 0.35)
  Top 0.152: JTAG_HEADER.15 22.88,46.7 26.1,46.7 v29,49.6 | v45.93,52.3 45.93,53 | 45.93,53 | 45.93,53 47.33,54.4 v55.94,54.4 | v58.62,58.21 58.91,58.5 58.91,58.91 58.35,59.47 58.35,64.92 56.35,66.92 U$9.P$26 | R16.1 v23.95,44.15 v23.94,44.15
  Bottom 0.152: v29,49.6 29.57,50.17 43.79,50.17 v45.93,52.3 | v55.94,54.4 56.5,54.96 56.5,57.54 56.36,57.67 56.36,58.09 56.66,58.38 57.08,58.38 57.25,58.21 v58.62,58.21 | v23.94,44.15 21.05,47.04 JTAG_HEADER.15
SCL  (via drill 0.35)
  Top 0.152: U$1.31 80.08,7.82 78.86,9.04 63.1,9.04 v63.09,9.05 | v61.39,9.05 60.7,9.73 60.7,55.23 59.72,56.22 v54.66,56.22 | v49.63,56.3 49.63,56.83 50.09,57.29 50.09,61.6 U$9.P$3
  Bottom 0.152: v61.39,9.05 61.4,9.06 63.07,9.06 v63.09,9.05 | v54.66,56.22 49.71,56.22 v49.63,56.3
SDA  (via drill 0.35)
  Top 0.152: U$1.32 77.54,7.66 76.66,8.54 62.7,8.54 61.14,10.09 61.14,55.32 59.8,56.66 55.8,56.66 55.24,57.22 v54.66,57.22 | v49.22,57.26 49.22,57.62 49.72,58.12 49.72,61.61 U$9.P$2
  Bottom 0.152: v54.66,57.22 54.1,56.65 50.05,56.65 49.81,56.89 49.58,56.89 v49.22,57.26
SWD_CLK  (via drill 0.35)
  Top 0.152: v29,48.7 26.56,46.26 22.5,46.26 22.03,46.73 15.23,46.73 JTAG_HEADER.9 | U$9.P$24 56.32,66.11 57.82,64.62 57.82,57.56 v58.18,57.2 | v46.47,51.67 46.47,52.81 47.47,53.81 57.72,53.81 58.12,54.21 v58.12,54.4
  Bottom 0.152: v29,48.7 30.2,49.9 44.73,49.9 46.47,51.64 v46.47,51.67 | v58.12,54.4 58.18,54.46 v58.18,57.2
SWD_IO  (via drill 0.35)
  Top 0.152: v29,47.8 27,45.8 22.22,45.8 21.69,46.33 14.89,46.33 14.49,46.73 12.69,46.73 JTAG_HEADER.7 | U$9.P$25 56.35,66.52 58.12,64.75 58.12,57.99 58.88,57.23 59.04,57.23 v59.07,57.2 | v47.02,50.98 47.02,52.93 47.66,53.57 58.32,53.57 58.92,54.17 v58.92,54.4
  Bottom 0.152: v29,47.8 30.83,49.63 44.75,49.63 45.42,50.3 46.34,50.3 v47.02,50.98 | v59.07,57.2 59.24,57.03 59.24,54.71 v58.92,54.4
TORPEDO1
  Top 1.5: TORPEDO_CONNECTOR.1 23.2,65.94 Q18.3
TORPEDO1_GATE
  Top 0.152: Q2.1 39.2,45.12 44.04,49.97 44.04,53.59 46.22,55.77 50.06,55.77 50.52,56.23 50.52,61.6 U$9.P$4
TORPEDO2
  Top 1.5: TORPEDO_CONNECTOR.2 14.77,78.57 12.84,76.64 12.84,71.47 18.1,66.2 18.1,62.36 23.21,57.25 Q6.3
TORPEDO2_GATE
  Top 0.152: Q3.1 35.69,44.25 39.52,44.25 40.19,44.92 40.19,45.36 44.3,49.48 44.3,53.53 46.25,55.47 50.26,55.47 50.9,56.12 50.9,56.46 50.91,56.44 U$9.P$5
USB_DN  (via drill 0.35)
  Top 0.152: R8.1 v35.68,66.11 | R13.2 15.6,66.3 v16.6,65.3
  Bottom 0.152: v35.68,66.11 17.41,66.11 v16.6,65.3
USB_DP  (via drill 0.35)
  Top 0.152: R1.2 16.56,63.84 v16.6,63.8 | R7.1 37.45,63.53 36.82,62.9 v36.24,62.9
  Bottom 0.152: v36.24,62.9 v36.25,62.9 18,62.9 17.1,63.8 v16.6,63.8
USB_ID
  Top 0.35: R11.2 R2.1
V+
  Top 1.5: U$6.P$2 28.66,16.93 22.31,16.93 POWER_INPUT.4
VBUS  (via drill 0.9)
  Top 0.8: USB_ID/USB_DP/USB_DN.VBUS 13.4,68.23 v13.4,68.3 | v51.2,81.6 52.3,81.6 VR1.3 53,84.25 C14.1
  Bottom 0.8: v13.4,68.3 13.86,68.76 43.36,68.76 50.3,75.7 50.3,80.7 v51.2,81.6

### Text on the board
tPlace: Illustrated By: Isabella Richardson, 2021 | The Underwater Robotics Team / Center for Automotive Research | Actuator Board
tNames: Microcontroller Debug